# EAGLE schematic discferret_main (EAGLE 6.6.0)

## Sheet 1 of 8
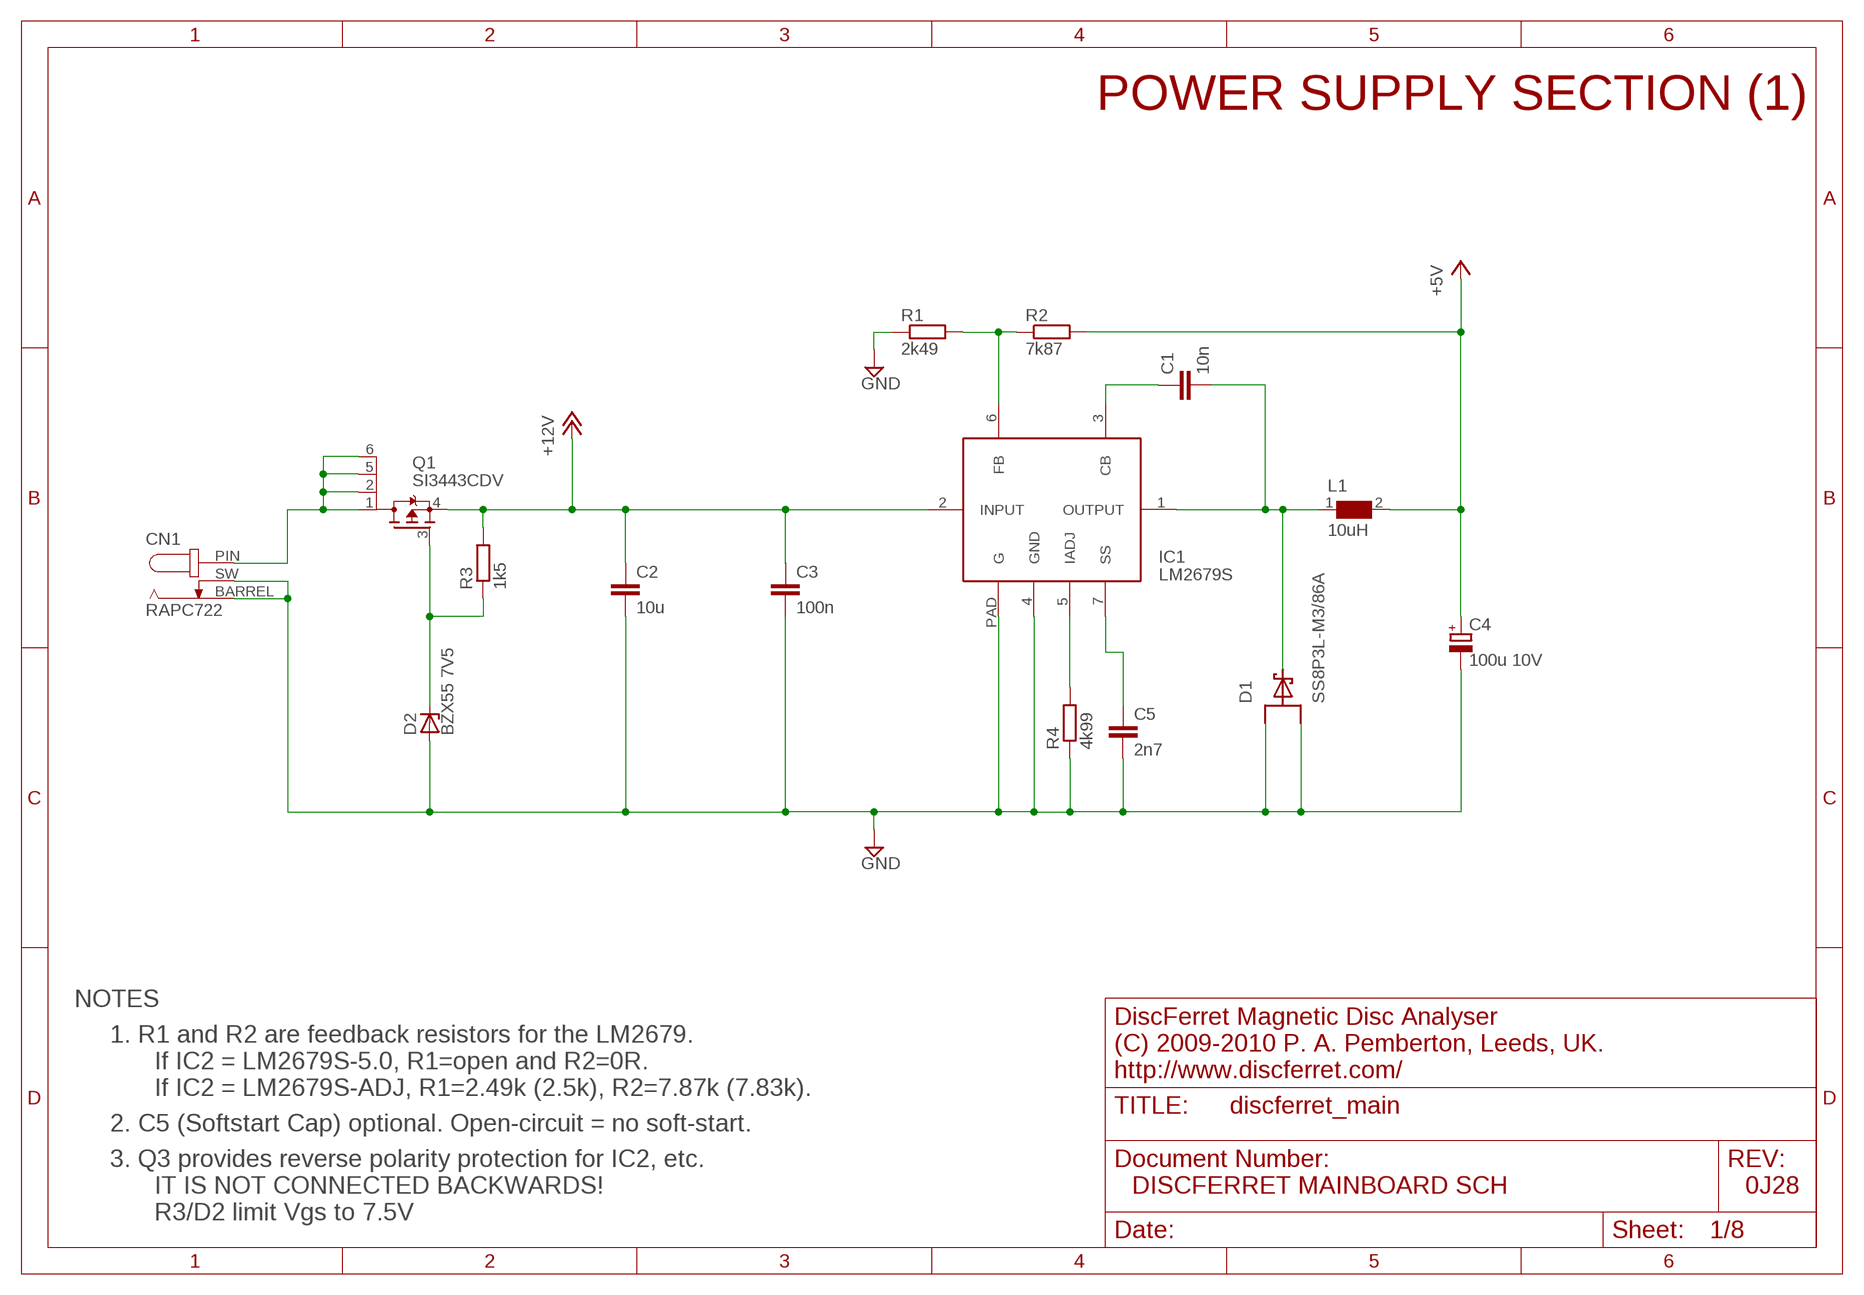
[diagram p0: schematic, sheet 1]

### Parts
C1  10n  C-EUC0603  [C0603]
C2  10u  C-EUC0805  [C0805]
C3  100n  C-EUC0603  [C0603]
C4  100u 10V  CPOL-EUSMCD  [SMC_D]
C5  2n7  C-EUC0805  [C0805]
CN1  RAPC722  RAPC722_NO_THERMALS  [RAPC722NT]
D1  SS8P3L-M3/86A  SS8PH9-LARGEPAD  [TO277A_SMPC_LARGEPAD]
D2  BZX55 7V5  BZX55  [DO35Z10]
IC1  LM2679S  LM2679  [TO263-7]
L1  10uH  WE-PD_L/LS/XL/XXL  [WE-PD_L/LS/XL/XXL]
Q1  SI3443CDV  SI3443CDV-LARGEPAD  [TSOP6_VISHAY_LARGEPAD]
R1  2k49  R-EU_R0805  [R0805]
R2  7k87  R-EU_R0805  [R0805]
R3  1k5  R-EU_R0805  [R0805]
R4  4k99  R-EU_R0805  [R0805]

### Nets
+5V: C4.+ L1.2 R2.2 ; also sheet 2,7,8
+12V: C2.1 C3.1 IC1.2(INPUT) Q1.4(S) R3.2 ; also sheet 8
GND: C2.2 C3.2 C4.- C5.2 CN1.BARREL(BAR) CN1.SW D1.1(A1) D1.2(A2) D2.A IC1.4(GND) IC1.PAD(G) R1.1 R4.1 ; also sheet 2,3,4,5,6,7,8
N$12: CN1.PIN Q1.1(D1) Q1.2(D2) Q1.5(D3) Q1.6(D4)
N$13: IC1.5(IADJ) R4.2
N$14: C1.1 IC1.3(CB)
N$15: C5.1 IC1.7(SS)
N$16: C1.2 D1.K(C) IC1.1(OUTPUT) L1.1
N$17: D2.C Q1.3(G) R3.1
N$18: IC1.6(FB) R1.2 R2.1

### Notes on the sheet
- POWER SUPPLY SECTION (1)
- NOTES
- DiscFerret Magnetic Disc Analyser
- 1. R1 and R2 are feedback resistors for the LM2679.
- (C) 2009-2010 P. A. Pemberton, Leeds, UK.
- If IC2 = LM2679S-5.0, R1=open and R2=0R.
- http://www.discferret.com/
- If IC2 = LM2679S-ADJ, R1=2.49k (2.5k), R2=7.87k (7.83k).
- 2. C5 (Softstart Cap) optional. Open-circuit = no soft-start.
- 3. Q3 provides reverse polarity protection for IC2, etc.
- IT IS NOT CONNECTED BACKWARDS! | DISCFERRET MAINBOARD SCH | 0J28
- R3/D2 limit Vgs to 7.5V

## Sheet 2 of 8
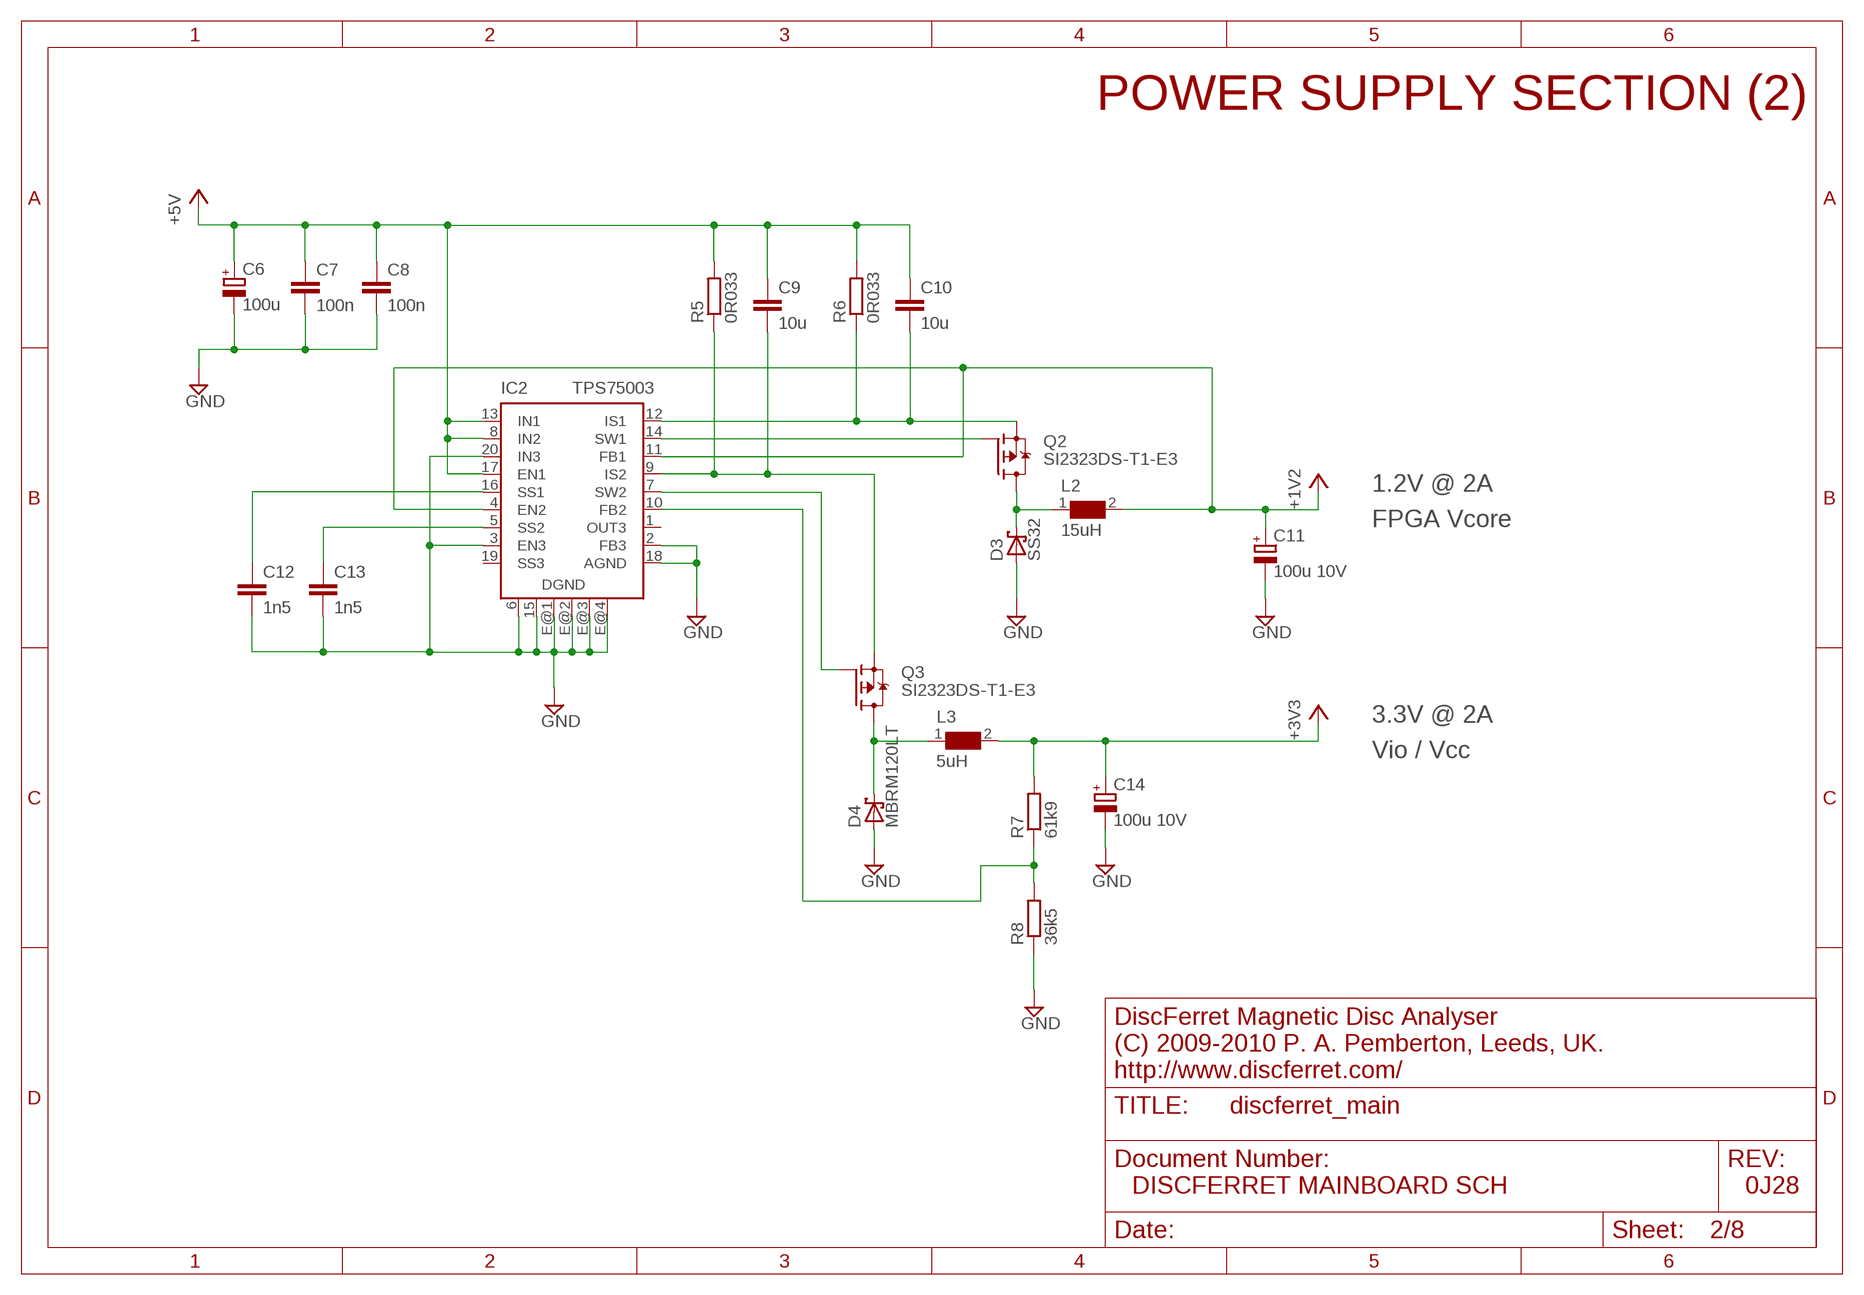
[diagram p1: schematic, sheet 2]

### Parts
C6  100u  CPOL-EUSMCD  [SMC_D]
C7  100n  C-EUC0805  [C0805]
C8  100n  C-EUC0805  [C0805]
C9  10u  C-EUC0805  [C0805]
C10  10u  C-EUC0805  [C0805]
C11  100u 10V  CPOL-EUSMCD  [SMC_D]
C12  1n5  C-EUC0805  [C0805]
C13  1n5  C-EUC0805  [C0805]
C14  100u 10V  CPOL-EUSMCD  [SMC_D]
D3  SS32  SCHOTTKY-DIODESMC  [SMC]
D4  MBRM120LT  MBRM120LT-LARGEPAD  [POWERMITE_LARGEPAD]
IC2  TPS75003  [R-PQFP-N20]
L2  15uH  WE-TPC_XL/XLH  [WE-TPC_XL/XLH]
L3  5uH  WE-TPC_XL/XLH  [WE-TPC_XL/XLH]
Q2  SI2323DS-T1-E3  [SOT23]
Q3  SI2323DS-T1-E3  [SOT23]
R5  0R033  R-EU_R1206  [R1206]
R6  0R033  R-EU_R1206  [R1206]
R7  61k9  R-EU_R0805  [R0805]
R8  36k5  R-EU_R0603  [R0603]

### Nets
+1V2: C11.+ IC2.4(EN2) IC2.11(FB1) L2.2 ; also sheet 5
+3V3: C14.+ L3.2 R7.2 ; also sheet 3,4,5,6,7,8
+5V: C6.+ C7.1 C8.1 C9.1 C10.1 IC2.8(IN2) IC2.13(IN1) IC2.17(EN1) R5.2 R6.2 ; also sheet 1,7,8
GND: C6.- C7.2 C8.2 C11.- C12.2 C13.2 C14.- D3.A D4.2(A) IC2.2(FB3) IC2.3(EN3) IC2.6(DGND) IC2.15(DGND) IC2.18(AGND) IC2.20(IN3) IC2.E@1(DGND) IC2.E@2(DGND) IC2.E@3(DGND) IC2.E@4(DGND) R8.1 ; also sheet 1,3,4,5,6,7,8
N$1: C9.2 IC2.9(IS2) Q3.2(S) R5.1
N$2: C12.1 IC2.16(SS1)
N$3: C13.1 IC2.5(SS2)
N$4: C10.2 IC2.12(IS1) Q2.2(S) R6.1
N$5: IC2.14(SW1) Q2.1(G)
N$6: IC2.7(SW2) Q3.1(G)
N$7: D3.C L2.1 Q2.3(D)
N$8: D4.1(C) L3.1 Q3.3(D)
N$10: IC2.10(FB2) R7.1 R8.2
Unconnected: IC2.1(OUT3) IC2.19(SS3)

### Notes on the sheet
- POWER SUPPLY SECTION (2)
- 1.2V @ 2A
- FPGA Vcore
- 3.3V @ 2A
- Vio / Vcc
- DiscFerret Magnetic Disc Analyser
- (C) 2009-2010 P. A. Pemberton, Leeds, UK.
- http://www.discferret.com/
- DISCFERRET MAINBOARD SCH | 0J28

## Sheet 3 of 8
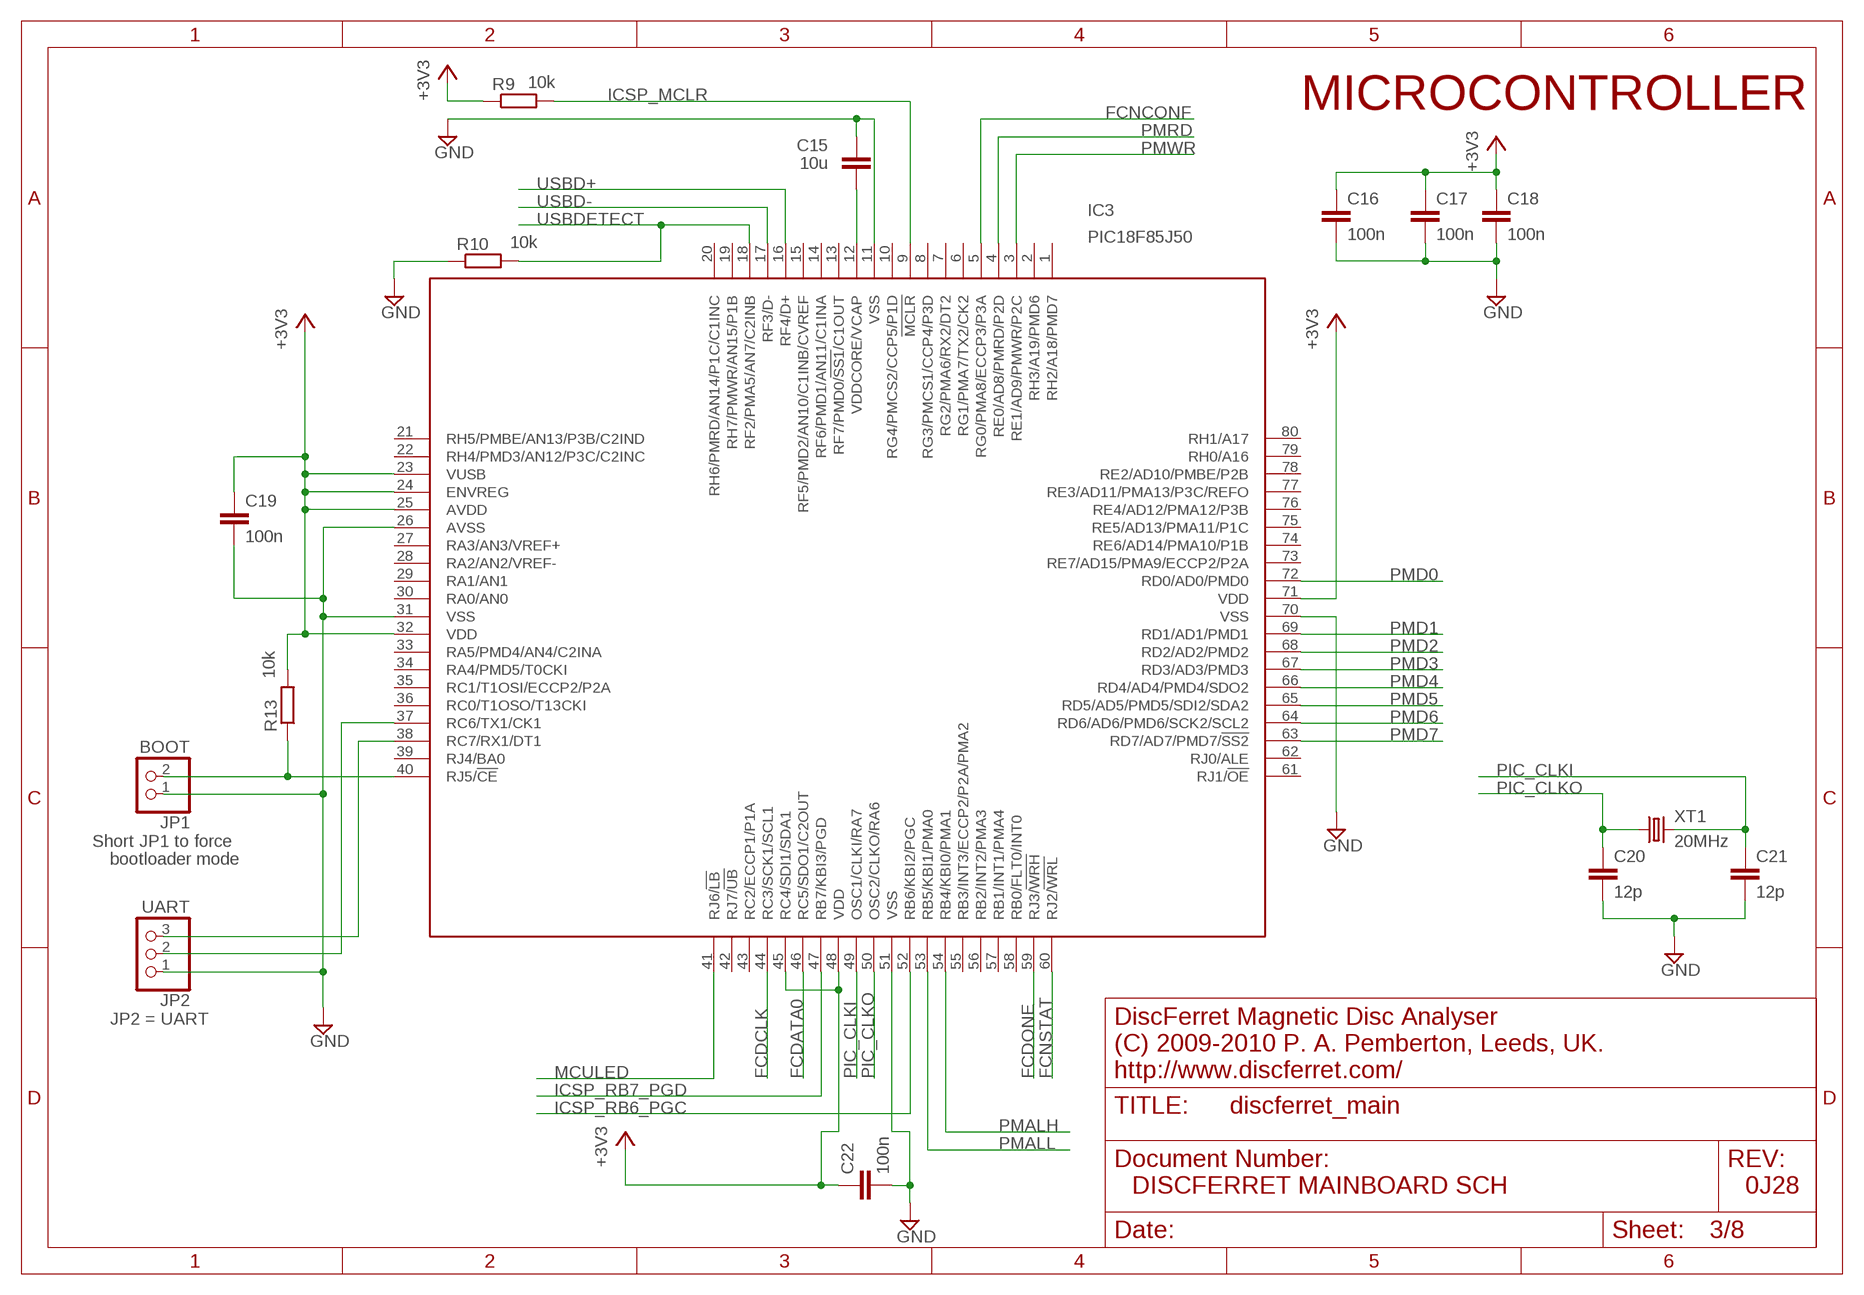
[diagram p2: schematic, sheet 3]

### Parts
C15  10u  C-EUC0805  [C0805]
C16  100n  C-EUC0603  [C0603]
C17  100n  C-EUC0603  [C0603]
C18  100n  C-EUC0603  [C0603]
C19  100n  C-EUC0603  [C0603]
C20  12p  C-EUC0603  [C0603]
C21  12p  C-EUC0603  [C0603]
C22  100n  C-EUC0603  [C0603]
IC3  PIC18F85J50  [TQFP80-12X12]
JP1  BOOT  PINHD-1X2  [1X02]
JP2  UART  PINHD-1X3  [1X03]
R9  10k  R-EU_R0805  [R0805]
R10  10k  R-EU_R0805  [R0805]
R13  10k  R-EU_R0805  [R0805]
XT1  20MHz  CRYSTALHC49S  [HC49/S]

### Nets
+3V3: C16.1 C17.1 C18.1 C19.1 C22.1 IC3.23(VUSB) IC3.24(ENVREG) IC3.25(AVDD) IC3.32(VDD) IC3.45(RC4/SDI1/SDA1) IC3.48(VDD) IC3.71(VDD) R9.1 R13.2 ; also sheet 2,4,5,6,7,8
FCDATA0: IC3.46(RC5/SDO1/C2OUT) ; also sheet 5
FCDCLK: IC3.44(RC3/SCK1/SCL1) ; also sheet 5
FCDONE: IC3.59(RJ3/!WRH) ; also sheet 5
FCNCONF: IC3.5(RG0/PMA8/ECCP3/P3A) ; also sheet 5
FCNSTAT: IC3.60(RJ2/!WRL) ; also sheet 5
GND: C15.1 C16.2 C17.2 C18.2 C19.2 C20.2 C21.2 C22.2 IC3.11(VSS) IC3.26(AVSS) IC3.31(VSS) IC3.51(VSS) IC3.70(VSS) JP1.1 JP2.1 R10.1 ; also sheet 1,2,4,5,6,7,8
ICSP_MCLR: IC3.9(!MCLR) R9.2 ; also sheet 4
ICSP_RB6_PGC: IC3.52(RB6/KBI2/PGC) ; also sheet 4
ICSP_RB7_PGD: IC3.47(RB7/KBI3/PGD) ; also sheet 4
MCULED: IC3.41(RJ6/!LB) ; also sheet 4
N$11: IC3.40(RJ5/!CE) JP1.2 R13.1
N$22: C15.2 IC3.12(VDDCORE/VCAP)
N$23: IC3.37(RC6/TX1/CK1) JP2.2
N$24: IC3.38(RC7/RX1/DT1) JP2.3
PIC_CLKI: C21.1 IC3.49(OSC1/CLKI/RA7) XT1.2
PIC_CLKO: C20.1 IC3.50(OSC2/CLKO/RA6) XT1.1
PMALH: IC3.54(RB4/KBI0/PMA1) ; also sheet 5
PMALL: IC3.53(RB5/KBI1/PMA0) ; also sheet 5
PMD0: IC3.72(RD0/AD0/PMD0) ; also sheet 5
PMD1: IC3.69(RD1/AD1/PMD1) ; also sheet 5
PMD2: IC3.68(RD2/AD2/PMD2) ; also sheet 5
PMD3: IC3.67(RD3/AD3/PMD3) ; also sheet 5
PMD4: IC3.66(RD4/AD4/PMD4/SDO2) ; also sheet 5
PMD5: IC3.65(RD5/AD5/PMD5/SDI2/SDA2) ; also sheet 5
PMD6: IC3.64(RD6/AD6/PMD6/SCK2/SCL2) ; also sheet 5
PMD7: IC3.63(RD7/AD7/PMD7/!SS2) ; also sheet 5
PMRD: IC3.4(RE0/AD8/PMRD/P2D) ; also sheet 5
PMWR: IC3.3(RE1/AD9/PMWR/P2C) ; also sheet 5
USBD+: IC3.16(RF4/D+) ; also sheet 4
USBD-: IC3.17(RF3/D-) ; also sheet 4
USBDETECT: IC3.18(RF2/PMA5/AN7/C2INB) R10.2 ; also sheet 4
Unconnected: IC3.1(RH2/A18/PMD7) IC3.2(RH3/A19/PMD6) IC3.6(RG1/PMA7/TX2/CK2) IC3.7(RG2/PMA6/RX2/DT2) IC3.8(RG3/PMCS1/CCP4/P3D) IC3.10(RG4/PMCS2/CCP5/P1D) IC3.13(RF7/PMD0/!SS1!/C1OUT) IC3.14(RF6/PMD1/AN11/C1INA) IC3.15(RF5/PMD2/AN10/C1INB/CVREF) IC3.19(RH7/PMWR/AN15/P1B) IC3.20(RH6/PMRD/AN14/P1C/C1INC) IC3.21(RH5/PMBE/AN13/P3B/C2IND) IC3.22(RH4/PMD3/AN12/P3C/C2INC) IC3.27(RA3/AN3/VREF+) IC3.28(RA2/AN2/VREF-) IC3.29(RA1/AN1) IC3.30(RA0/AN0) IC3.33(RA5/PMD4/AN4/C2INA) IC3.34(RA4/PMD5/T0CKI) IC3.35(RC1/T1OSI/ECCP2/P2A) IC3.36(RC0/T1OSO/T13CKI) IC3.39(RJ4/BA0) IC3.42(RJ7/!UB) IC3.43(RC2/ECCP1/P1A) IC3.55(RB3/INT3/ECCP2/P2A/PMA2) IC3.56(RB2/INT2/PMA3) IC3.57(RB1/INT1/PMA4) IC3.58(RB0/FLT0/INT0) IC3.61(RJ1/!OE) IC3.62(RJ0/ALE) IC3.73(RE7/AD15/PMA9/ECCP2/P2A) IC3.74(RE6/AD14/PMA10/P1B) IC3.75(RE5/AD13/PMA11/P1C) IC3.76(RE4/AD12/PMA12/P3B) IC3.77(RE3/AD11/PMA13/P3C/REFO) IC3.78(RE2/AD10/PMBE/P2B) IC3.79(RH0/A16) IC3.80(RH1/A17)

### Notes on the sheet
- MICROCONTROLLER
- Short JP1 to force
- bootloader mode
- JP2 = UART | DiscFerret Magnetic Disc Analyser
- (C) 2009-2010 P. A. Pemberton, Leeds, UK.
- http://www.discferret.com/
- DISCFERRET MAINBOARD SCH | 0J28

## Sheet 4 of 8
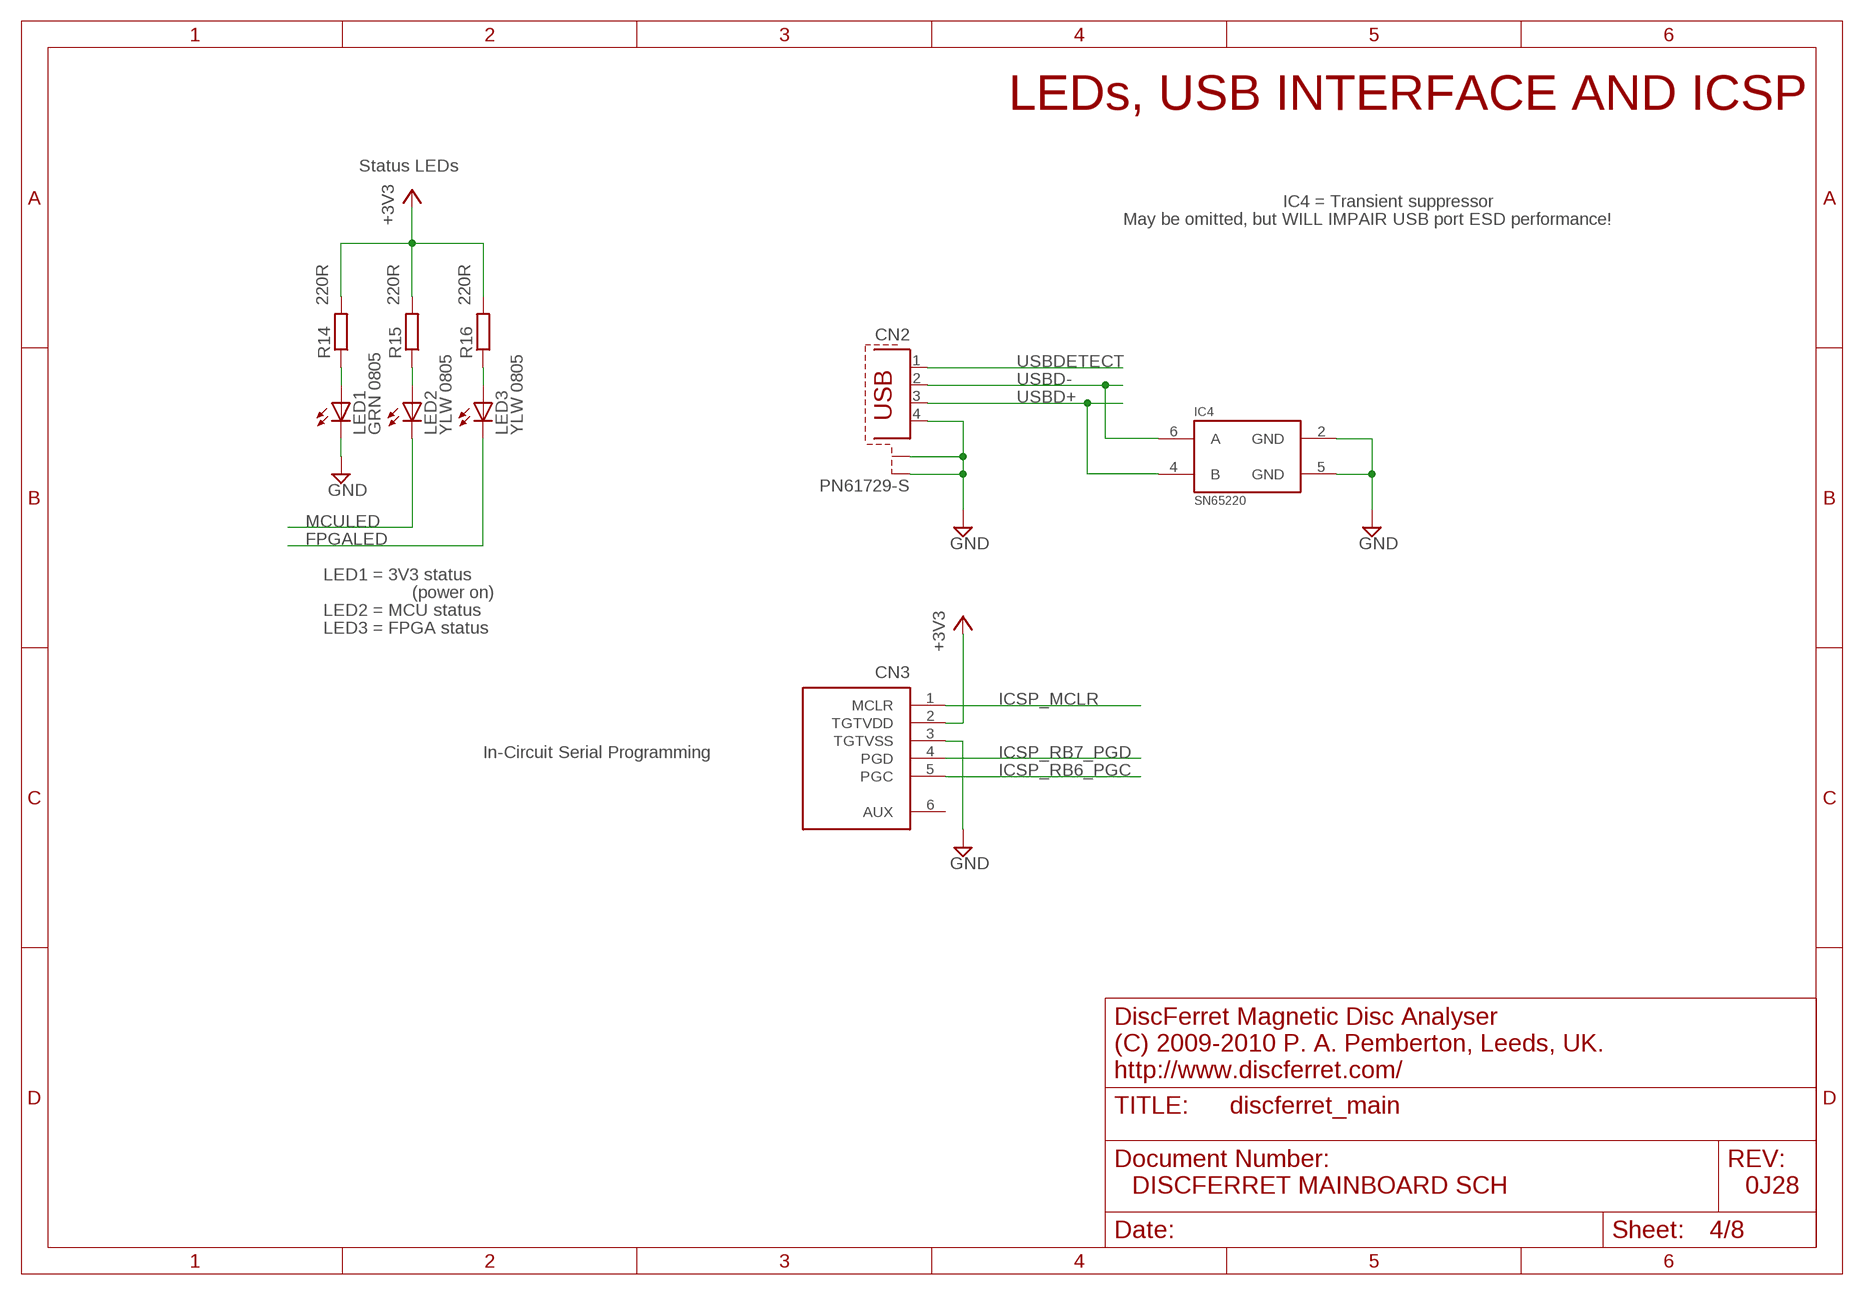
[diagram p3: schematic, sheet 4]

### Parts
CN2  PN61729-S  [PN61729-S]
CN3  ICSPSMD  [ICSP_SMD]
IC4  SN65220  [SOT23-6L]
LED1  GRN 0805  LEDCHIPLED_0805  [CHIPLED_0805]
LED2  YLW 0805  LEDCHIPLED_0805  [CHIPLED_0805]
LED3  YLW 0805  LEDCHIPLED_0805  [CHIPLED_0805]
R14  220R  R-EU_R0805  [R0805]
R15  220R  R-EU_R0805  [R0805]
R16  220R  R-EU_R0805  [R0805]

### Nets
+3V3: CN3.2(TGTVDD) R14.2 R15.2 R16.2 ; also sheet 2,3,5,6,7,8
FPGALED: LED3.C ; also sheet 5
GND: CN2.4 CN2.S1 CN2.S2 CN3.3(TGTVSS) IC4.2(GND) IC4.5(GND) LED1.C ; also sheet 1,2,3,5,6,7,8
ICSP_MCLR: CN3.1(MCLR) ; also sheet 3
ICSP_RB6_PGC: CN3.5(PGC) ; also sheet 3
ICSP_RB7_PGD: CN3.4(PGD) ; also sheet 3
MCULED: LED2.C ; also sheet 3
N$19: LED1.A R14.1
N$20: LED2.A R15.1
N$21: LED3.A R16.1
USBD+: CN2.3 IC4.4(B) ; also sheet 3
USBD-: CN2.2 IC4.6(A) ; also sheet 3
USBDETECT: CN2.1 ; also sheet 3
Unconnected: CN3.6(AUX)

### Notes on the sheet
- LEDs, USB INTERFACE AND ICSP
- Status LEDs
- IC4 = Transient suppressor
- May be omitted, but WILL IMPAIR USB port ESD performance!
- LED1 = 3V3 status
- (power on)
- LED2 = MCU status
- LED3 = FPGA status
- In-Circuit Serial Programming
- DiscFerret Magnetic Disc Analyser
- (C) 2009-2010 P. A. Pemberton, Leeds, UK.
- http://www.discferret.com/
- DISCFERRET MAINBOARD SCH | 0J28

## Sheet 5 of 8
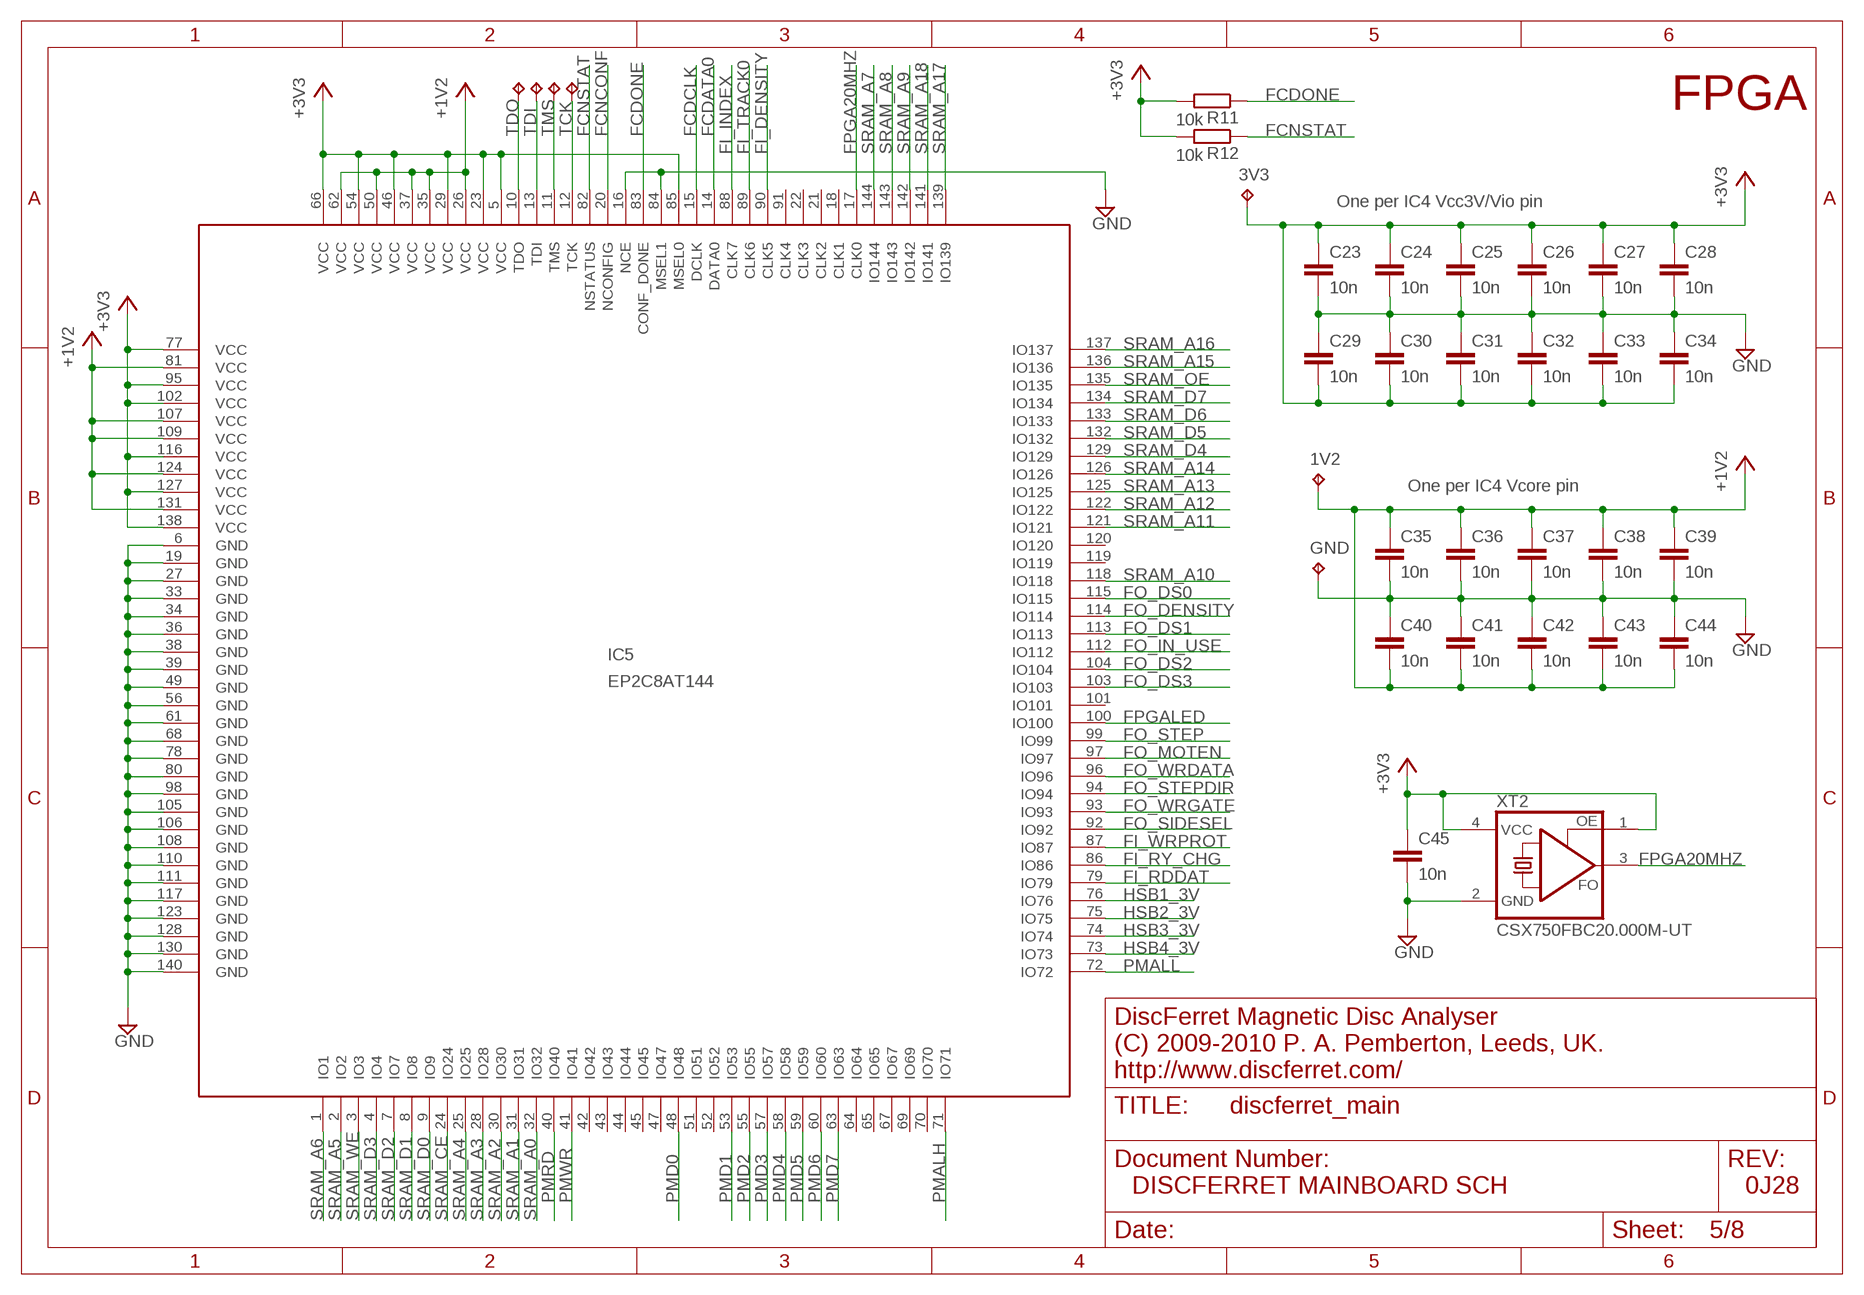
[diagram p4: schematic, sheet 5]

### Parts
1V2  TPB1,27  [B1,27]
3V3  TPB1,27  [B1,27]
C23  10n  C-EUC0603  [C0603]
C24  10n  C-EUC0603  [C0603]
C25  10n  C-EUC0603  [C0603]
C26  10n  C-EUC0603  [C0603]
C27  10n  C-EUC0603  [C0603]
C28  10n  C-EUC0603  [C0603]
C29  10n  C-EUC0603  [C0603]
C30  10n  C-EUC0603  [C0603]
C31  10n  C-EUC0603  [C0603]
C32  10n  C-EUC0603  [C0603]
C33  10n  C-EUC0603  [C0603]
C34  10n  C-EUC0603  [C0603]
C35  10n  C-EUC0603  [C0603]
C36  10n  C-EUC0603  [C0603]
C37  10n  C-EUC0603  [C0603]
C38  10n  C-EUC0603  [C0603]
C39  10n  C-EUC0603  [C0603]
C40  10n  C-EUC0603  [C0603]
C41  10n  C-EUC0603  [C0603]
C42  10n  C-EUC0603  [C0603]
C43  10n  C-EUC0603  [C0603]
C44  10n  C-EUC0603  [C0603]
C45  10n  C-EUC0603  [C0603]
GND  TPB1,27  [B1,27]
IC5  EP2C8AT144  [TQFP144]
R11  10k  R-EU_R0805  [R0805]
R12  10k  R-EU_R0805  [R0805]
TCK  TPB1,27  [B1,27]
TDI  TPB1,27  [B1,27]
TDO  TPB1,27  [B1,27]
TMS  TPB1,27  [B1,27]
XT2  CSX750FBC20.000M-UT  CSX750F  [CSX750F]

### Nets
+1V2: 1V2.TP C35.1 C36.1 C37.1 C38.1 C39.1 C40.2 C41.2 C42.2 C43.2 C44.2 IC5.26(VCC) IC5.35(VCC) IC5.37(VCC) IC5.50(VCC) IC5.62(VCC) IC5.81(VCC) IC5.107(VCC) IC5.109(VCC) IC5.124(VCC) IC5.131(VCC) ; also sheet 2
+3V3: 3V3.TP C23.1 C24.1 C25.1 C26.1 C27.1 C28.1 C29.2 C30.2 C31.2 C32.2 C33.2 C34.2 C45.1 IC5.5(VCC) IC5.23(VCC) IC5.29(VCC) IC5.46(VCC) IC5.54(VCC) IC5.66(VCC) IC5.77(VCC) IC5.85(MSEL0) IC5.95(VCC) IC5.102(VCC) IC5.116(VCC) IC5.127(VCC) IC5.138(VCC) R11.2 R12.2 XT2.1(OE) XT2.4(VCC) ; also sheet 2,3,4,6,7,8
FCDATA0: IC5.14(DATA0) ; also sheet 3
FCDCLK: IC5.15(DCLK) ; also sheet 3
FCDONE: IC5.83(CONF_DONE) R11.1 ; also sheet 3
FCNCONF: IC5.20(NCONFIG) ; also sheet 3
FCNSTAT: IC5.82(NSTATUS) R12.1 ; also sheet 3
FI_DENSITY: IC5.90(CLK5) ; also sheet 7
FI_INDEX: IC5.88(CLK7) ; also sheet 7
FI_RDDAT: IC5.79(IO79) ; also sheet 7
FI_RY_CHG: IC5.86(IO86) ; also sheet 7
FI_TRACK0: IC5.89(CLK6) ; also sheet 7
FI_WRPROT: IC5.87(IO87) ; also sheet 7
FO_DENSITY: IC5.114(IO114) ; also sheet 8
FO_DS0: IC5.115(IO115) ; also sheet 8
FO_DS1: IC5.113(IO113) ; also sheet 8
FO_DS2: IC5.104(IO104) ; also sheet 8
FO_DS3: IC5.103(IO103) ; also sheet 8
FO_IN_USE: IC5.112(IO112) ; also sheet 8
FO_MOTEN: IC5.97(IO97) ; also sheet 8
FO_SIDESEL: IC5.92(IO92) ; also sheet 8
FO_STEP: IC5.99(IO99) ; also sheet 8
FO_STEPDIR: IC5.94(IO94) ; also sheet 8
FO_WRDATA: IC5.96(IO96) ; also sheet 8
FO_WRGATE: IC5.93(IO93) ; also sheet 8
FPGA20MHZ: IC5.17(CLK0) XT2.3(FO)
FPGALED: IC5.100(IO100) ; also sheet 4
GND: C23.2 C24.2 C25.2 C26.2 C27.2 C28.2 C29.1 C30.1 C31.1 C32.1 C33.1 C34.1 C35.2 C36.2 C37.2 C38.2 C39.2 C40.1 C41.1 C42.1 C43.1 C44.1 C45.2 GND.TP IC5.6(GND) IC5.16(NCE) IC5.19(GND) IC5.27(GND) IC5.33(GND) IC5.34(GND) IC5.36(GND) IC5.38(GND) IC5.39(GND) IC5.49(GND) IC5.56(GND) IC5.61(GND) IC5.68(GND) IC5.78(GND) IC5.80(GND) IC5.84(MSEL1) IC5.98(GND) IC5.105(GND) IC5.106(GND) IC5.108(GND) IC5.110(GND) IC5.111(GND) IC5.117(GND) IC5.123(GND) IC5.128(GND) IC5.130(GND) IC5.140(GND) XT2.2(GND) ; also sheet 1,2,3,4,6,7,8
HSB1_3V: IC5.76(IO76) ; also sheet 7
HSB2_3V: IC5.75(IO75) ; also sheet 7
HSB3_3V: IC5.74(IO74) ; also sheet 7
HSB4_3V: IC5.73(IO73) ; also sheet 7
PMALH: IC5.71(IO71) ; also sheet 3
PMALL: IC5.72(IO72) ; also sheet 3
PMD0: IC5.48(IO48) ; also sheet 3
PMD1: IC5.53(IO53) ; also sheet 3
PMD2: IC5.55(IO55) ; also sheet 3
PMD3: IC5.57(IO57) ; also sheet 3
PMD4: IC5.58(IO58) ; also sheet 3
PMD5: IC5.59(IO59) ; also sheet 3
PMD6: IC5.60(IO60) ; also sheet 3
PMD7: IC5.63(IO63) ; also sheet 3
PMRD: IC5.40(IO40) ; also sheet 3
PMWR: IC5.41(IO41) ; also sheet 3
SRAM_A0: IC5.32(IO32) ; also sheet 6
SRAM_A1: IC5.31(IO31) ; also sheet 6
SRAM_A2: IC5.30(IO30) ; also sheet 6
SRAM_A3: IC5.28(IO28) ; also sheet 6
SRAM_A4: IC5.25(IO25) ; also sheet 6
SRAM_A5: IC5.2(IO2) ; also sheet 6
SRAM_A6: IC5.1(IO1) ; also sheet 6
SRAM_A7: IC5.144(IO144) ; also sheet 6
SRAM_A8: IC5.143(IO143) ; also sheet 6
SRAM_A9: IC5.142(IO142) ; also sheet 6
SRAM_A10: IC5.118(IO118) ; also sheet 6
SRAM_A11: IC5.121(IO121) ; also sheet 6
SRAM_A12: IC5.122(IO122) ; also sheet 6
SRAM_A13: IC5.125(IO125) ; also sheet 6
SRAM_A14: IC5.126(IO126) ; also sheet 6
SRAM_A15: IC5.136(IO136) ; also sheet 6
SRAM_A16: IC5.137(IO137) ; also sheet 6
SRAM_A17: IC5.139(IO139) ; also sheet 6
SRAM_A18: IC5.141(IO141) ; also sheet 6
SRAM_CE: IC5.24(IO24) ; also sheet 6
SRAM_D0: IC5.9(IO9) ; also sheet 6
SRAM_D1: IC5.8(IO8) ; also sheet 6
SRAM_D2: IC5.7(IO7) ; also sheet 6
SRAM_D3: IC5.4(IO4) ; also sheet 6
SRAM_D4: IC5.129(IO129) ; also sheet 6
SRAM_D5: IC5.132(IO132) ; also sheet 6
SRAM_D6: IC5.133(IO133) ; also sheet 6
SRAM_D7: IC5.134(IO134) ; also sheet 6
SRAM_OE: IC5.135(IO135) ; also sheet 6
SRAM_WE: IC5.3(IO3) ; also sheet 6
TCK: IC5.12(TCK) TCK.TP
TDI: IC5.13(TDI) TDI.TP
TDO: IC5.10(TDO) TDO.TP
TMS: IC5.11(TMS) TMS.TP
Unconnected: IC5.18(CLK1) IC5.21(CLK2) IC5.22(CLK3) IC5.42(IO42) IC5.43(IO43) IC5.44(IO44) IC5.45(IO45) IC5.47(IO47) IC5.51(IO51) IC5.52(IO52) IC5.64(IO64) IC5.65(IO65) IC5.67(IO67) IC5.69(IO69) IC5.70(IO70) IC5.91(CLK4) IC5.101(IO101) IC5.119(IO119) IC5.120(IO120)

### Notes on the sheet
- FPGA
- One per IC4 Vcc3V/Vio pin
- One per IC4 Vcore pin
- DiscFerret Magnetic Disc Analyser
- (C) 2009-2010 P. A. Pemberton, Leeds, UK.
- http://www.discferret.com/
- DISCFERRET MAINBOARD SCH | 0J28

## Sheet 6 of 8
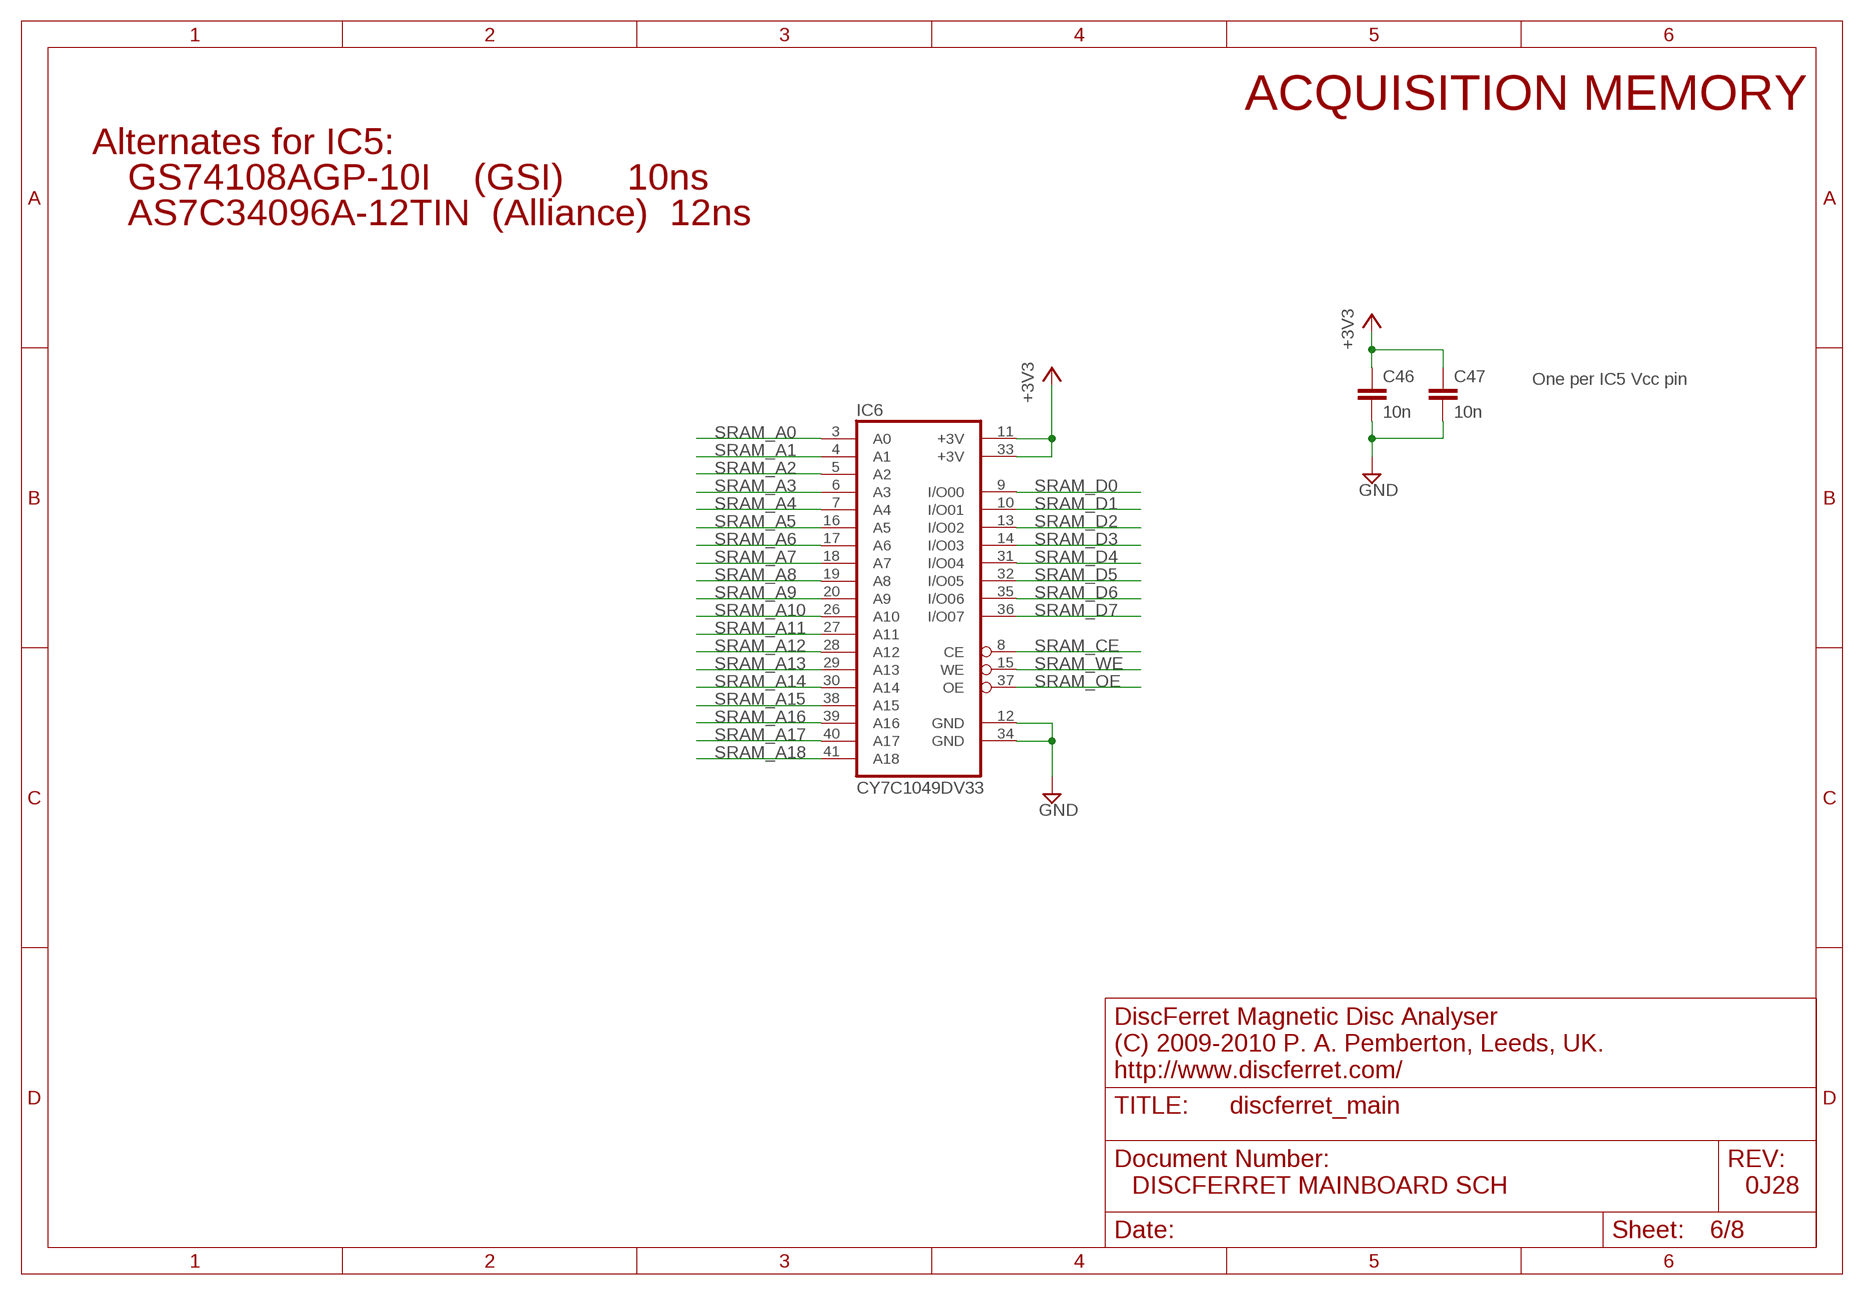
[diagram p5: schematic, sheet 6]

### Parts
C46  10n  C-EUC0603  [C0603]
C47  10n  C-EUC0603  [C0603]
IC6  CY7C1049DV33  CY7C1049CV33T  [TSOPII-Z44]

### Nets
+3V3: C46.1 C47.1 IC6.11(+3V) IC6.33(+3V) ; also sheet 2,3,4,5,7,8
GND: C46.2 C47.2 IC6.12(GND) IC6.34(GND) ; also sheet 1,2,3,4,5,7,8
SRAM_A0: IC6.3(A0) ; also sheet 5
SRAM_A1: IC6.4(A1) ; also sheet 5
SRAM_A2: IC6.5(A2) ; also sheet 5
SRAM_A3: IC6.6(A3) ; also sheet 5
SRAM_A4: IC6.7(A4) ; also sheet 5
SRAM_A5: IC6.16(A5) ; also sheet 5
SRAM_A6: IC6.17(A6) ; also sheet 5
SRAM_A7: IC6.18(A7) ; also sheet 5
SRAM_A8: IC6.19(A8) ; also sheet 5
SRAM_A9: IC6.20(A9) ; also sheet 5
SRAM_A10: IC6.26(A10) ; also sheet 5
SRAM_A11: IC6.27(A11) ; also sheet 5
SRAM_A12: IC6.28(A12) ; also sheet 5
SRAM_A13: IC6.29(A13) ; also sheet 5
SRAM_A14: IC6.30(A14) ; also sheet 5
SRAM_A15: IC6.38(A15) ; also sheet 5
SRAM_A16: IC6.39(A16) ; also sheet 5
SRAM_A17: IC6.40(A17) ; also sheet 5
SRAM_A18: IC6.41(A18) ; also sheet 5
SRAM_CE: IC6.8(CE) ; also sheet 5
SRAM_D0: IC6.9(I/O00) ; also sheet 5
SRAM_D1: IC6.10(I/O01) ; also sheet 5
SRAM_D2: IC6.13(I/O02) ; also sheet 5
SRAM_D3: IC6.14(I/O03) ; also sheet 5
SRAM_D4: IC6.31(I/O04) ; also sheet 5
SRAM_D5: IC6.32(I/O05) ; also sheet 5
SRAM_D6: IC6.35(I/O06) ; also sheet 5
SRAM_D7: IC6.36(I/O07) ; also sheet 5
SRAM_OE: IC6.37(OE) ; also sheet 5
SRAM_WE: IC6.15(WE) ; also sheet 5

### Notes on the sheet
- ACQUISITION MEMORY
- Alternates for IC5:
- GS74108AGP-10I    (GSI)      10ns
- AS7C34096A-12TIN  (Alliance)  12ns
- One per IC5 Vcc pin
- DiscFerret Magnetic Disc Analyser
- (C) 2009-2010 P. A. Pemberton, Leeds, UK.
- http://www.discferret.com/
- DISCFERRET MAINBOARD SCH | 0J28

## Sheet 7 of 8
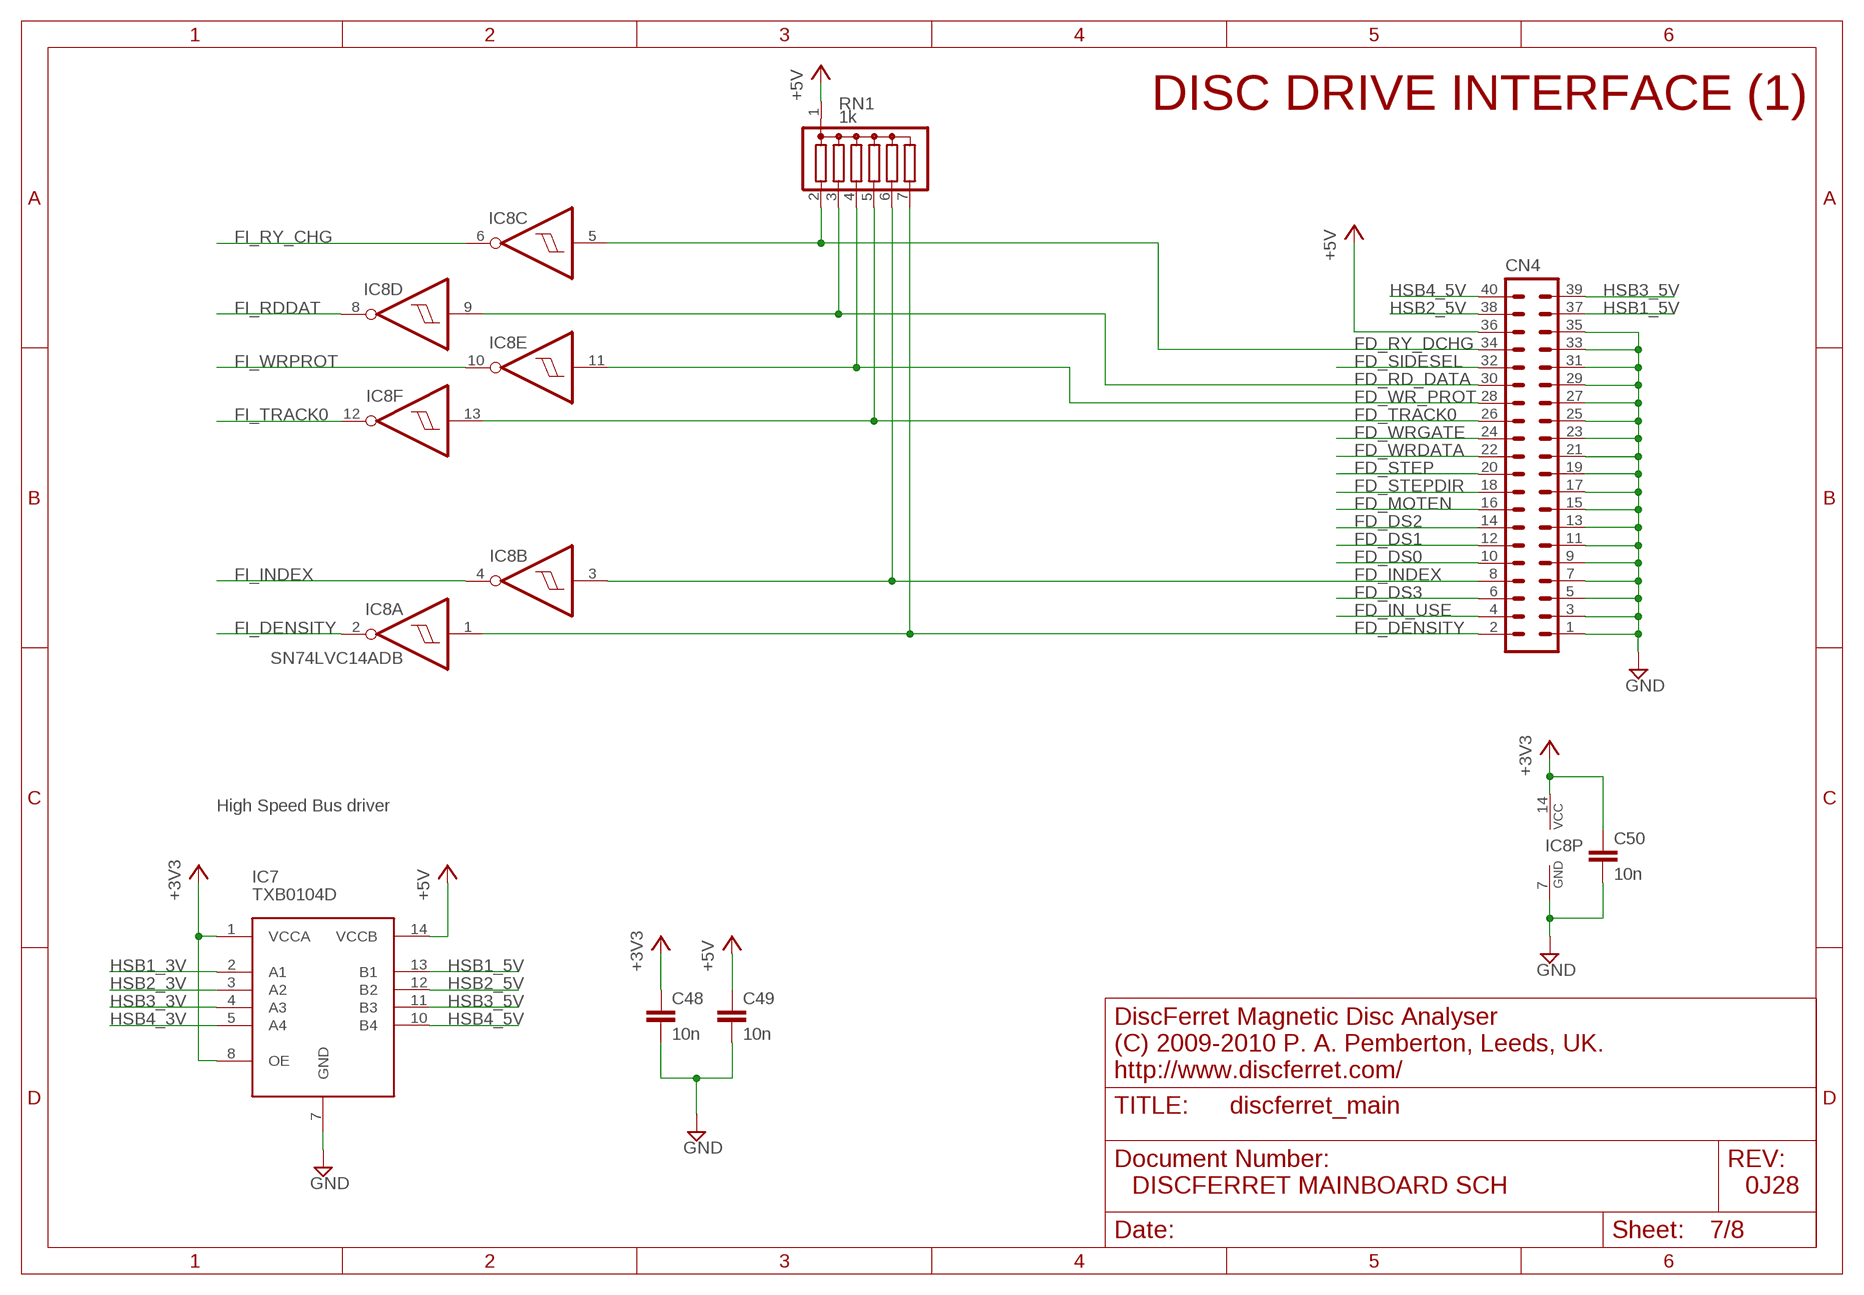
[diagram p6: schematic, sheet 7]

### Parts
C48  10n  C-EUC0603  [C0603]
C49  10n  C-EUC0603  [C0603]
C50  10n  C-EUC0603  [C0603]
CN4  40H  [40H]
IC7  TXB0104D  [SO14]
IC8  SN74LVC14ADB  [SSOP14]
RN1  1k  G06R  [SIL7]

### Nets
+3V3: C48.1 C50.1 IC7.1(VCCA) IC7.8(OE) IC8.14(P:VCC) ; also sheet 2,3,4,5,6,8
+5V: C49.1 CN4.36 IC7.14(VCCB) RN1.1 ; also sheet 1,2,8
FD_DENSITY: CN4.2 IC8.1(A:I) RN1.7 ; also sheet 8
FD_DS0: CN4.10 ; also sheet 8
FD_DS1: CN4.12 ; also sheet 8
FD_DS2: CN4.14 ; also sheet 8
FD_DS3: CN4.6 ; also sheet 8
FD_IN_USE: CN4.4 ; also sheet 8
FD_INDEX: CN4.8 IC8.3(B:I) RN1.6
FD_MOTEN: CN4.16 ; also sheet 8
FD_RD_DATA: CN4.30 IC8.9(D:I) RN1.3
FD_RY_DCHG: CN4.34 IC8.5(C:I) RN1.2
FD_SIDESEL: CN4.32 ; also sheet 8
FD_STEP: CN4.20 ; also sheet 8
FD_STEPDIR: CN4.18 ; also sheet 8
FD_TRACK0: CN4.26 IC8.13(F:I) RN1.5
FD_WR_PROT: CN4.28 IC8.11(E:I) RN1.4
FD_WRDATA: CN4.22 ; also sheet 8
FD_WRGATE: CN4.24 ; also sheet 8
FI_DENSITY: IC8.2(A:O) ; also sheet 5
FI_INDEX: IC8.4(B:O) ; also sheet 5
FI_RDDAT: IC8.8(D:O) ; also sheet 5
FI_RY_CHG: IC8.6(C:O) ; also sheet 5
FI_TRACK0: IC8.12(F:O) ; also sheet 5
FI_WRPROT: IC8.10(E:O) ; also sheet 5
GND: C48.2 C49.2 C50.2 CN4.1 CN4.3 CN4.5 CN4.7 CN4.9 CN4.11 CN4.13 CN4.15 CN4.17 CN4.19 CN4.21 CN4.23 CN4.25 CN4.27 CN4.29 CN4.31 CN4.33 CN4.35 IC7.7(GND) IC8.7(P:GND) ; also sheet 1,2,3,4,5,6,8
HSB1_3V: IC7.2(A1) ; also sheet 5
HSB1_5V: CN4.37 IC7.13(B1)
HSB2_3V: IC7.3(A2) ; also sheet 5
HSB2_5V: CN4.38 IC7.12(B2)
HSB3_3V: IC7.4(A3) ; also sheet 5
HSB3_5V: CN4.39 IC7.11(B3)
HSB4_3V: IC7.5(A4) ; also sheet 5
HSB4_5V: CN4.40 IC7.10(B4)

### Notes on the sheet
- DISC DRIVE INTERFACE (1)
- High Speed Bus driver
- DiscFerret Magnetic Disc Analyser
- (C) 2009-2010 P. A. Pemberton, Leeds, UK.
- http://www.discferret.com/
- DISCFERRET MAINBOARD SCH | 0J28

## Sheet 8 of 8
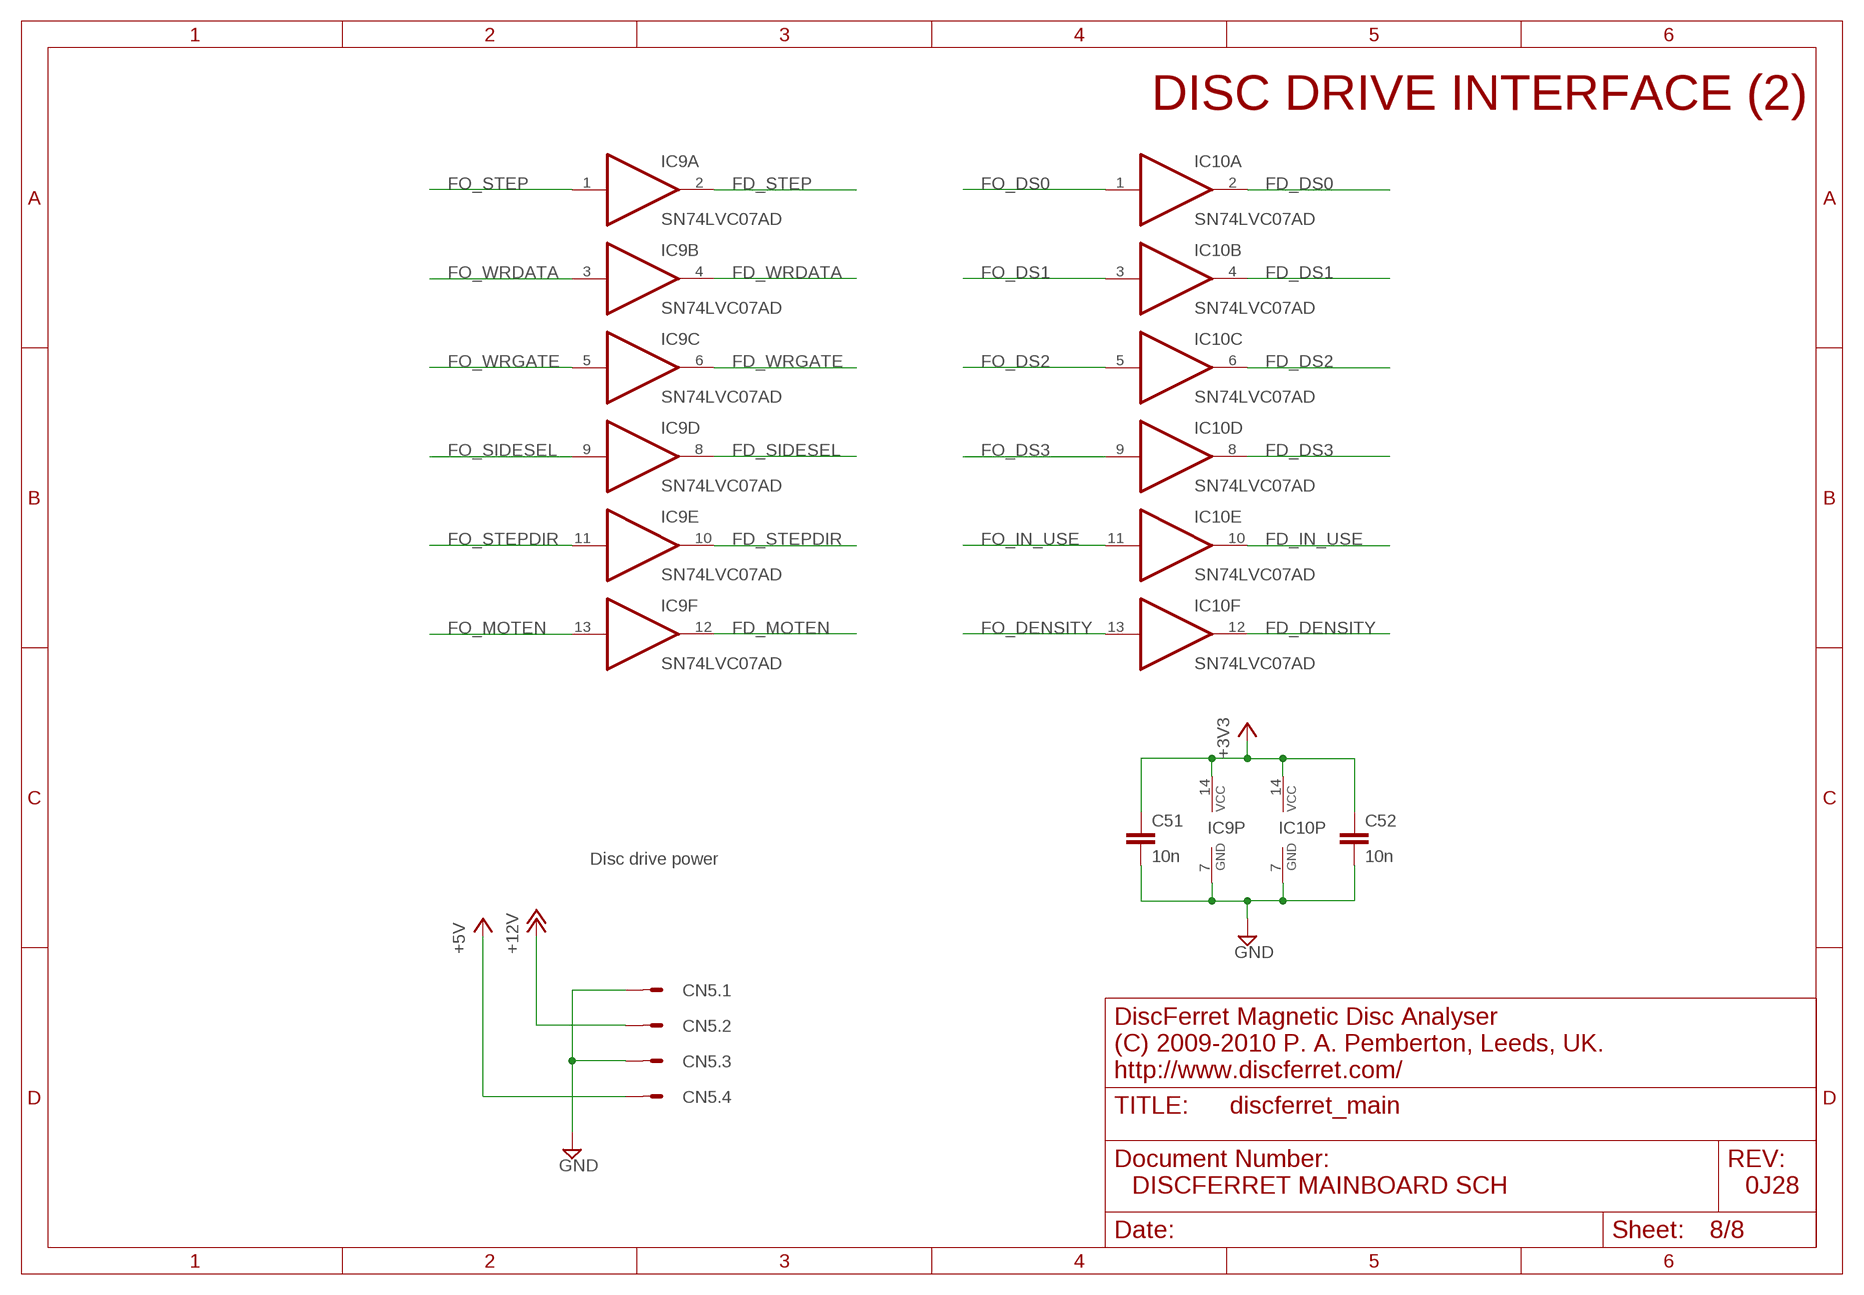
[diagram p7: schematic, sheet 8]

### Parts
C51  10n  C-EUC0603  [C0603]
C52  10n  C-EUC0603  [C0603]
CN5  2X2-A  [3-794618-4]
IC9  SN74LVC07AD  [SO14]
IC10  SN74LVC07AD  [SO14]

### Nets
+3V3: C51.1 C52.1 IC9.14(P:VCC) IC10.14(P:VCC) ; also sheet 2,3,4,5,6,7
+5V: CN5.4 ; also sheet 1,2,7
+12V: CN5.2 ; also sheet 1
FD_DENSITY: IC10.12(F:O) ; also sheet 7
FD_DS0: IC10.2(A:O) ; also sheet 7
FD_DS1: IC10.4(B:O) ; also sheet 7
FD_DS2: IC10.6(C:O) ; also sheet 7
FD_DS3: IC10.8(D:O) ; also sheet 7
FD_IN_USE: IC10.10(E:O) ; also sheet 7
FD_MOTEN: IC9.12(F:O) ; also sheet 7
FD_SIDESEL: IC9.8(D:O) ; also sheet 7
FD_STEP: IC9.2(A:O) ; also sheet 7
FD_STEPDIR: IC9.10(E:O) ; also sheet 7
FD_WRDATA: IC9.4(B:O) ; also sheet 7
FD_WRGATE: IC9.6(C:O) ; also sheet 7
FO_DENSITY: IC10.13(F:I) ; also sheet 5
FO_DS0: IC10.1(A:I) ; also sheet 5
FO_DS1: IC10.3(B:I) ; also sheet 5
FO_DS2: IC10.5(C:I) ; also sheet 5
FO_DS3: IC10.9(D:I) ; also sheet 5
FO_IN_USE: IC10.11(E:I) ; also sheet 5
FO_MOTEN: IC9.13(F:I) ; also sheet 5
FO_SIDESEL: IC9.9(D:I) ; also sheet 5
FO_STEP: IC9.1(A:I) ; also sheet 5
FO_STEPDIR: IC9.11(E:I) ; also sheet 5
FO_WRDATA: IC9.3(B:I) ; also sheet 5
FO_WRGATE: IC9.5(C:I) ; also sheet 5
GND: C51.2 C52.2 CN5.1 CN5.3 IC9.7(P:GND) IC10.7(P:GND) ; also sheet 1,2,3,4,5,6,7

### Notes on the sheet
- DISC DRIVE INTERFACE (2)
- Disc drive power
- DiscFerret Magnetic Disc Analyser
- (C) 2009-2010 P. A. Pemberton, Leeds, UK.
- http://www.discferret.com/
- DISCFERRET MAINBOARD SCH | 0J28

## Library data of the parts
1V2 3V3 GND TCK TDI TDO TMS = testpad:TP: Test pad
C1 C3 C5 C7 C8 C16-C52 = rcl:C-EU: CAPACITOR, European symbol
C2 C9 C10 C15 = rcl:C-EU: CAPACITOR, European symbol; MANUF-PN: GRM21BR61C106KE15L; MANUFACTURER: Murata; SUPPLIER: FARNELL; SUPPLIER-PN: 1762635
C4 C11 C14 = rcl:CPOL-EU: POLARIZED CAPACITOR, European symbol; MANUF-PN: TPSD107K010R0100; MANUFACTURER: AVX; SUPPLIER: FARNELL; SUPPLIER-PN: 570370
C6 = rcl:CPOL-EU: POLARIZED CAPACITOR, European symbol; MANUF-PN: TR3D107K010C0050; MANUFACTURER: Vishay Sprague; SUPPLIER: FARNELL; SUPPLIER-PN: 1754067
C12 C13 = rcl:C-EU: CAPACITOR, European symbol; MANUF-PN: MCCA000355; MANUFACTURER: Multicomp; SUPPLIER: FARNELL; SUPPLIER-PN: 1759232
CN1 = DFlocal:RAPC722: DC POWER JACK Power Jack, DC, Right Angle, Through Hole, Rated 5A at 12VDC, PC Terminals Distributor: Rapid Manufacturer: Switchcraft Type: RAPC 722; MANUF-PN: RAPC722; MANUFACTURER: Switchcraft; SUPPLIER: Rapid Electronics; SUPPLIER-PN: 20-0960
CN2 = con-berg:PN61729-S: BERG USB connector
CN3 = ICSP:ICSP
CN4 = con-harting-h:40H: CONNECTOR; MANUF-PN: MC9B232-4034; MANUFACTURER: Multicomp; SUPPLIER: FARNELL; SUPPLIER-PN: 1099021
CN5 = con-amp-micro-mate-n-lock:2X2
D1 = DFlocal:SS8PH9; MANUF-PN: SS8P3L-M3/86A; MANUFACTURER: Vishay General Semiconductor; SUPPLIER: FARNELL; SUPPLIER-PN: 1812499
D2 = diode:BZX55: Z DIODE
D3 = diode:SCHOTTKY-DIODE: Schottky Diode; MANUF-PN: SS32; MANUFACTURER: Multicomp; SUPPLIER: FARNELL; SUPPLIER-PN: 1625259
D4 = DFlocal:MBRM120LT: Schottky Diode; MANUF-PN: MBRM120LT1G; MANUFACTURER: ON Semiconductor; SUPPLIER: FARNELL; SUPPLIER-PN: 9555994
IC1 = DFlocal:LM2679: SIMPLE SWITCHER 5A switch-mode power supply controller Input voltage range: 8-40V Output current: 5A; MANUF-PN: LM2679S-ADJ; MANUFACTURER: National Semiconductor; SUPPLIER: FARNELL; SUPPLIER-PN: 9486194
IC2 = DFlocal:TPS75003: Triple-Supply Power Management IC for Powering FPGAs and DSPs Source: http://focus.ti.com/lit/ds/symlink/tps75003.pdf; MANUF-PN: TPS75003RHLT; MANUFACTURER: Texas Instruments; SUPPLIER: FARNELL; SUPPLIER-PN: 9969187
IC3 = microchip:PIC18F8*J5: PIC18F87J50 Family 64/80-Pin High-Performance, 1-Mbit Flash USB Microcontrollers with nanoWatt Technology Source: http://ww1.microchip.com/downloads/en/DeviceDoc/39775b.pdf
IC4 = DFlocal:SN65220: USB port transient suppressor Texas Instruments.; MANUF-PN: SN65220DBVT; MANUFACTURER: Texas Instruments; SUPPLIER: FARNELL; SUPPLIER-PN: 8451990
IC5 = altera-cyclone-II:EP2C8AT144: EP2C8AT144 Auto generated by make-symbol-device-package-bsdl.ulp Rev. 19 Source: EP2C8AT144.BSD; MANUF-PN: EP2C8T144C8N; MANUFACTURER: Altera; SUPPLIER: FARNELL; SUPPLIER-PN: 1453487
IC6 = memory-sram:CY7C1049CV33: 4-Mbit (512K x 8) Static RAM Source: CYPRESS cy7c1049cv33_8.pdf; MANUF-PN: CY7C1049DV33-10ZSXI; MANUFACTURER: Cypress Semiconductor; SUPPLIER: FARNELL; SUPPLIER-PN: 1688739
IC7 = DFlocal:TXB0104; MANUF-PN: TXB0104D; MANUFACTURER: Texas Instruments; SUPPLIER: FARNELL; SUPPLIER-PN: 1607890
IC8 = DFlocal:SN74LVC14A: Hex schmitt trigger INVERTER; MANUF-PN: SN74LVC14ADB; MANUFACTURER: Texas Instruments; SUPPLIER: FARNELL; SUPPLIER-PN: 1236311
IC9 IC10 = DFlocal:SN74LVC07A: Hex BUFFER, open collector high-voltage output; MANUF-PN: SN74LVC07AD; MANUFACTURER: Texas Instruments; SUPPLIER: FARNELL; SUPPLIER-PN: 9592660
JP1 = pinhead:PINHD-1X2: PIN HEADER
JP2 = pinhead:PINHD-1X3: PIN HEADER
L1 = DFlocal:WE-PD: SMD-Shielded Power Inductors WE-PD - Magnetically shielded version which results in a low leakage field - High storage capacity - Low self-losses - Highest possible current loading for SMD-Inducors -- Switching regulators with low operating voltages (computer, laptop, mobile phones, pagers) -- Integrated DC/DC-converter -- Is recommended for the application with switching regulators from National Semiconductor, Linear Technology, Texas Instruments and Fairchild Semiconductor, ect. -- Graphic cards -- Plastic base: Because of the one piece construction these are more suitable for high vibration or shock applications; MANUF-PN: 74477010; MANUFACTURER: Wurth Elektronik; SUPPLIER: FARNELL; SUPPLIER-PN: 1635925
L2 = DFlocal:WE-TPC: Shielded Tiny Power Inductor WE-TPC - Extremely flat power inductor - High current capability - High reliability and perfect soldering characteristics because of integrated soldering pad - magnetically shielded -- Portable power like PDA, digital camera, PCMICA-cards and displays -- DC/DC-converter -- Recommended for switching regulator IC's from Linear Technology, National Semiconductor, Texas Instruments and Fairchild Semiconductor; MANUF-PN: SRU1038-150Y; MANUFACTURER: Bourns; SUPPLIER: FARNELL; SUPPLIER-PN: 1612719
L3 = DFlocal:WE-TPC: Shielded Tiny Power Inductor WE-TPC - Extremely flat power inductor - High current capability - High reliability and perfect soldering characteristics because of integrated soldering pad - magnetically shielded -- Portable power like PDA, digital camera, PCMICA-cards and displays -- DC/DC-converter -- Recommended for switching regulator IC's from Linear Technology, National Semiconductor, Texas Instruments and Fairchild Semiconductor; MANUF-PN: 744066005; MANUFACTURER: Wuerth Elektronik; SUPPLIER: FARNELL; SUPPLIER-PN: 1635892
LED1 = led:LED: LED OSRAM: - CHIPLED LG R971, LG N971, LY N971, LG Q971, LY Q971, LO R971, LY R971 LH N974, LH R974 LS Q976, LO Q976, LY Q976 LO Q996 - Hyper CHIPLED LW Q18S LB Q993, LB Q99A, LB R99A - SideLED LS A670, LO A670, LY A670, LG A670, LP A670 LB A673, LV A673, LT A673, LW A673 LH A674 LY A675 LS A676, LA A676, LO A676, LY A676, LW A676 LS A679, LY A679, LG A679 - Hyper Micro SIDELED® LS Y876, LA Y876, LO Y876, LY Y876 LT Y87S - SmartLED LW L88C, LW L88S LB L89C, LB L89S, LG L890 LS L89K, LO L89K, LY L89K LS L896, LA L896, LO L896, LY L896 - TOPLED LS T670, LO T670, LY T670, LG T670, LP T670 LSG T670, LSP T670, LSY T670, LOP T670, LYG T670 LG T671, LOG T671, LSG T671 LB T673, LV T673, LT T673, LW T673 LH T674 LS T676, LA T676, LO T676, LY T676, LB T676, LH T676, LSB T676, LW T676 LB T67C, LV T67C, LT T67C, LS T67K, LO T67K, LY T67K, LW E67C LS E67B, LA E67B, LO E67B, LY E67B, LB E67C, LV E67C, LT E67C LW T67C LS T679, LY T679, LG T679 LS T770, LO T770, LY T770, LG T770, LP T770 LB T773, LV T773, LT T773, LW T773 LH T774 LS E675, LA E675, LY E675, LS T675 LS T776, LA T776, LO T776, LY T776, LB T776 LHGB T686 LT T68C, LB T68C - Hyper Mini TOPLED® LB M676 - Mini TOPLED Santana® LG M470 LS M47K, LO M47K, LY M47K Source: http://www.osram.convergy.de LUXEON: - LUMILED® LXK2-PW12-R00, LXK2-PW12-S00, LXK2-PW14-U00, LXK2-PW14-V00 LXK2-PM12-R00, LXK2-PM12-S00, LXK2-PM14-U00 LXK2-PE12-Q00, LXK2-PE12-R00, LXK2-PE12-S00, LXK2-PE14-T00, LXK2-PE14-U00 LXK2-PB12-K00, LXK2-PB12-L00, LXK2-PB12-M00, LXK2-PB14-N00, LXK2-PB14-P00, LXK2-PB14-Q00 LXK2-PR12-L00, LXK2-PR12-M00, LXK2-PR14-Q00, LXK2-PR14-R00 LXK2-PD12-Q00, LXK2-PD12-R00, LXK2-PD12-S00 LXK2-PH12-R00, LXK2-PH12-S00 LXK2-PL12-P00, LXK2-PL12-Q00, LXK2-PL12-R00 Source: www.luxeon.com KINGBRIGHT: KA-3528ASYC Source: www.kingbright.com; MANUF-PN: 5988170107F; MANUFACTURER: Dialight Corporation; SUPPLIER: FARNELL; SUPPLIER-PN: 1465996
LED2 LED3 = led:LED: LED OSRAM: - CHIPLED LG R971, LG N971, LY N971, LG Q971, LY Q971, LO R971, LY R971 LH N974, LH R974 LS Q976, LO Q976, LY Q976 LO Q996 - Hyper CHIPLED LW Q18S LB Q993, LB Q99A, LB R99A - SideLED LS A670, LO A670, LY A670, LG A670, LP A670 LB A673, LV A673, LT A673, LW A673 LH A674 LY A675 LS A676, LA A676, LO A676, LY A676, LW A676 LS A679, LY A679, LG A679 - Hyper Micro SIDELED® LS Y876, LA Y876, LO Y876, LY Y876 LT Y87S - SmartLED LW L88C, LW L88S LB L89C, LB L89S, LG L890 LS L89K, LO L89K, LY L89K LS L896, LA L896, LO L896, LY L896 - TOPLED LS T670, LO T670, LY T670, LG T670, LP T670 LSG T670, LSP T670, LSY T670, LOP T670, LYG T670 LG T671, LOG T671, LSG T671 LB T673, LV T673, LT T673, LW T673 LH T674 LS T676, LA T676, LO T676, LY T676, LB T676, LH T676, LSB T676, LW T676 LB T67C, LV T67C, LT T67C, LS T67K, LO T67K, LY T67K, LW E67C LS E67B, LA E67B, LO E67B, LY E67B, LB E67C, LV E67C, LT E67C LW T67C LS T679, LY T679, LG T679 LS T770, LO T770, LY T770, LG T770, LP T770 LB T773, LV T773, LT T773, LW T773 LH T774 LS E675, LA E675, LY E675, LS T675 LS T776, LA T776, LO T776, LY T776, LB T776 LHGB T686 LT T68C, LB T68C - Hyper Mini TOPLED® LB M676 - Mini TOPLED Santana® LG M470 LS M47K, LO M47K, LY M47K Source: http://www.osram.convergy.de LUXEON: - LUMILED® LXK2-PW12-R00, LXK2-PW12-S00, LXK2-PW14-U00, LXK2-PW14-V00 LXK2-PM12-R00, LXK2-PM12-S00, LXK2-PM14-U00 LXK2-PE12-Q00, LXK2-PE12-R00, LXK2-PE12-S00, LXK2-PE14-T00, LXK2-PE14-U00 LXK2-PB12-K00, LXK2-PB12-L00, LXK2-PB12-M00, LXK2-PB14-N00, LXK2-PB14-P00, LXK2-PB14-Q00 LXK2-PR12-L00, LXK2-PR12-M00, LXK2-PR14-Q00, LXK2-PR14-R00 LXK2-PD12-Q00, LXK2-PD12-R00, LXK2-PD12-S00 LXK2-PH12-R00, LXK2-PH12-S00 LXK2-PL12-P00, LXK2-PL12-Q00, LXK2-PL12-R00 Source: www.luxeon.com KINGBRIGHT: KA-3528ASYC Source: www.kingbright.com; MANUF-PN: 5988140107F; MANUFACTURER: Dialight Corporation; SUPPLIER: FARNELL; SUPPLIER-PN: 1465993
Q1 = DFlocal:SI3443CDV; MANUF-PN: SI3443CDV-T1-GE3; MANUFACTURER: Vishay; SUPPLIER: FARNELL; SUPPLIER-PN: 1779261
Q2 Q3 = DFlocal:SI2323: SIPMOS(R) Small-Signal-Transistor P-Channel, Enhancement mode Source: http://www.infineon.com/upload/Document/BSP170P_Rev2.4.pdf; MANUF-PN: SI2323DS-T1-E3; MANUFACTURER: Vishay Siliconix; SUPPLIER: FARNELL; SUPPLIER-PN: 1470106
R1 = rcl:R-EU_: RESISTOR, European symbol; MANUF-PN: CRCW08052K49FKEA; MANUFACTURER: Vishay Draloric; SUPPLIER: FARNELL; SUPPLIER-PN: 1469889
R2 = rcl:R-EU_: RESISTOR, European symbol; MANUF-PN: PCF0805R-7K87BT1; MANUFACTURER: Welwyn; SUPPLIER: FARNELL; SUPPLIER-PN: 1353306
R3 = rcl:R-EU_: RESISTOR, European symbol; MANUF-PN: MC 0.1W 0805 5% 1K5; MANUFACTURER: Multicomp; SUPPLIER: FARNELL; SUPPLIER-PN: 9333924
R4 R7-R16 = rcl:R-EU_: RESISTOR, European symbol
R5 R6 = rcl:R-EU_: RESISTOR, European symbol; MANUF-PN: LR1206-R033FI; MANUFACTURER: Welwyn; SUPPLIER: FARNELL; SUPPLIER-PN: 1099911
RN1 = resistor-sil:G06R: SIL RESISTOR; MANUF-PN: 4609X-101-102LF; MANUFACTURER: Bourns; SUPPLIER: FARNELL; SUPPLIER-PN: 9356800
XT1 = crystal:CRYSTAL: CRYSTAL; MANUF-PN: ABL-20.000MHZ-B2; MANUFACTURER: Abracon; SUPPLIER: FARNELL; SUPPLIER-PN: 1611779
XT2 = DFlocal:CSX750F; MANUF-PN: CSX750FBC20.000M-UT; MANUFACTURER: Citizen America; SUPPLIER: FARNELL; SUPPLIER-PN: 1611844